# EAGLE board A20-OLinuXino-Lime2_Rev_E (EAGLE 4.16), part 1 of 6
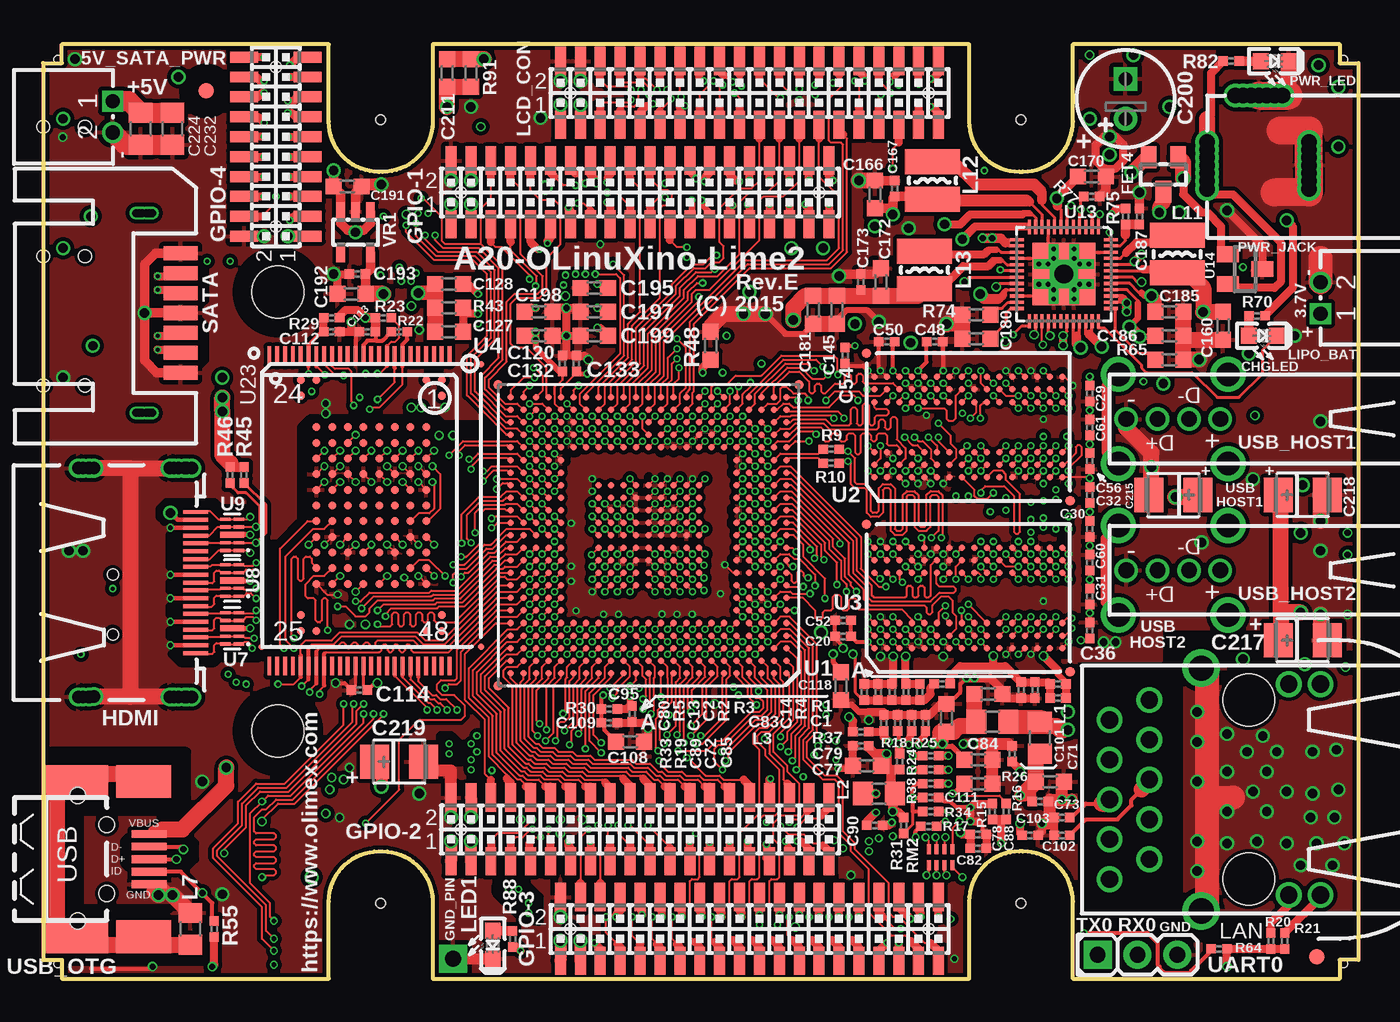
[diagram p5: board, top side]
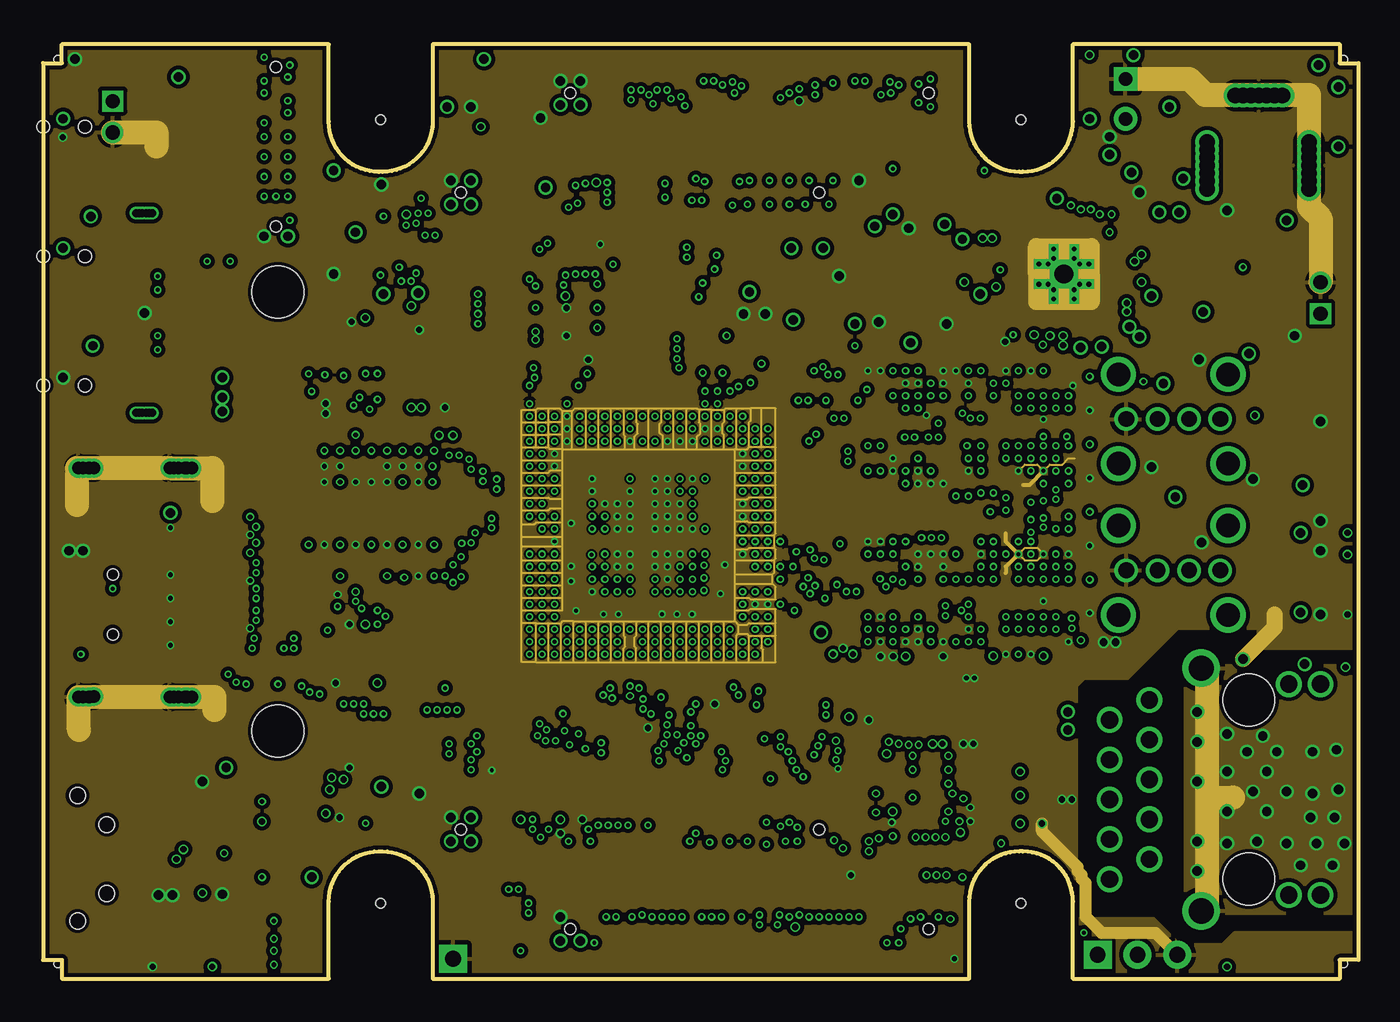
[diagram p6: board, inner layer GND]
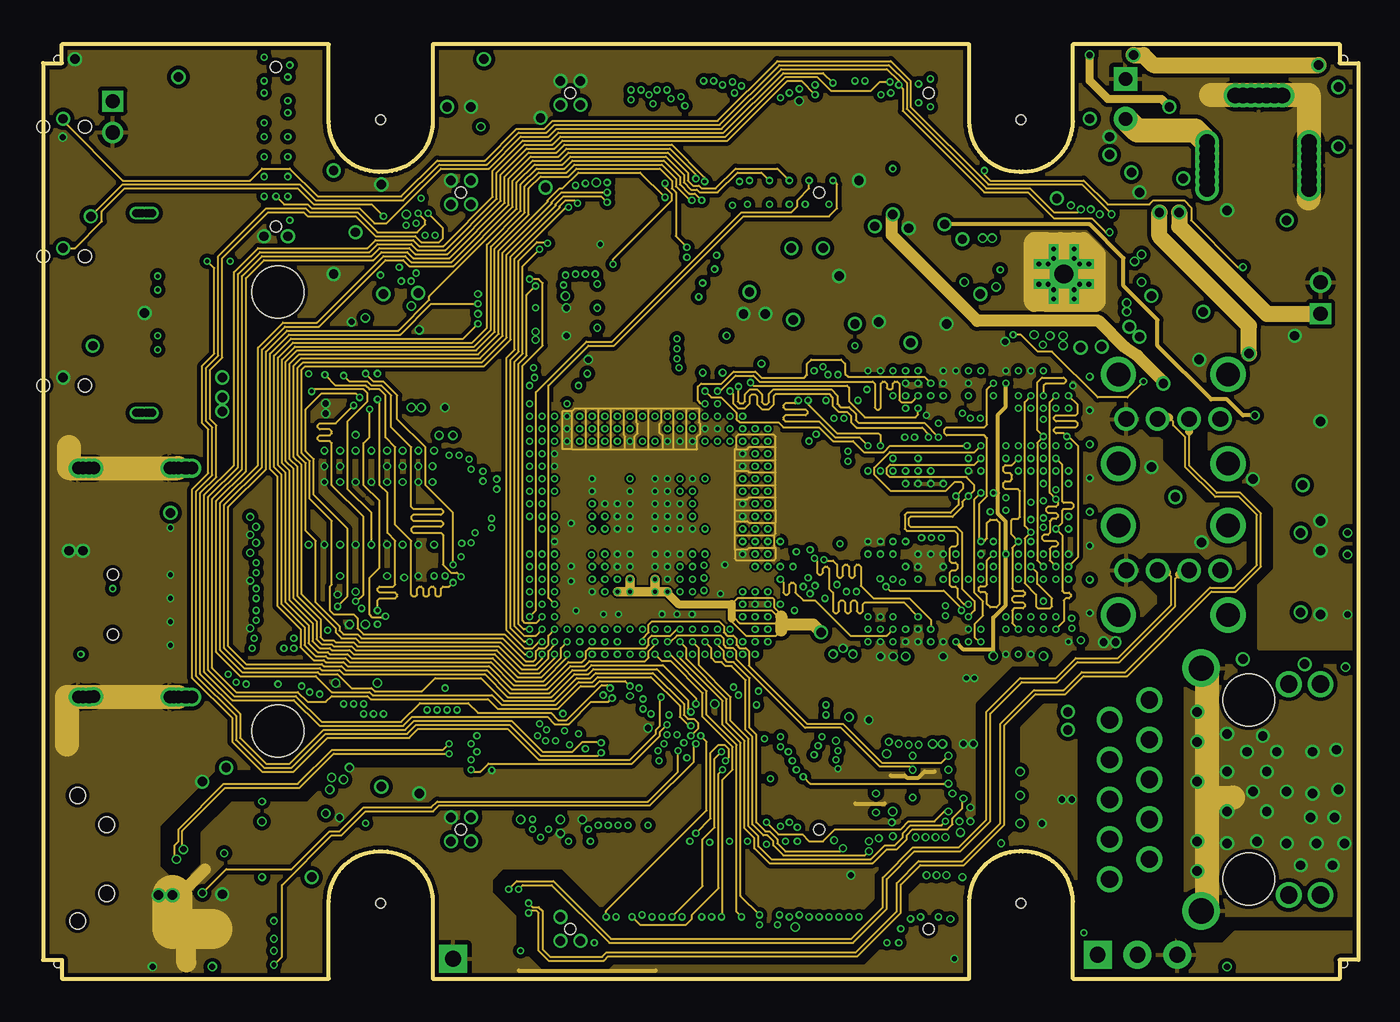
[diagram p7: board, inner layer Route3]
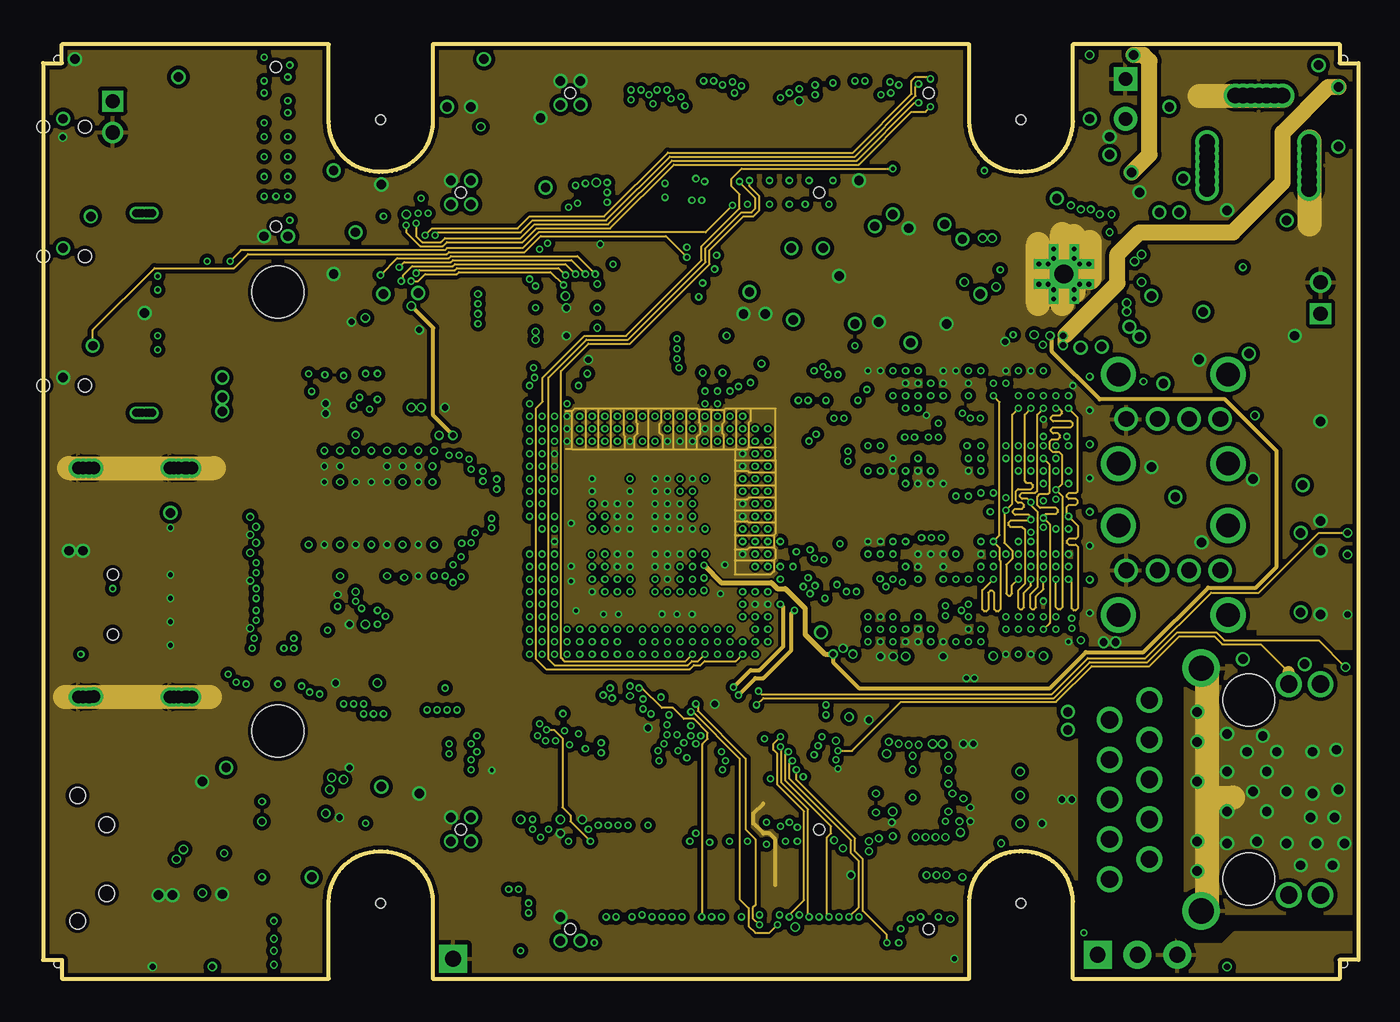
[diagram p8: board, inner layer Route4]
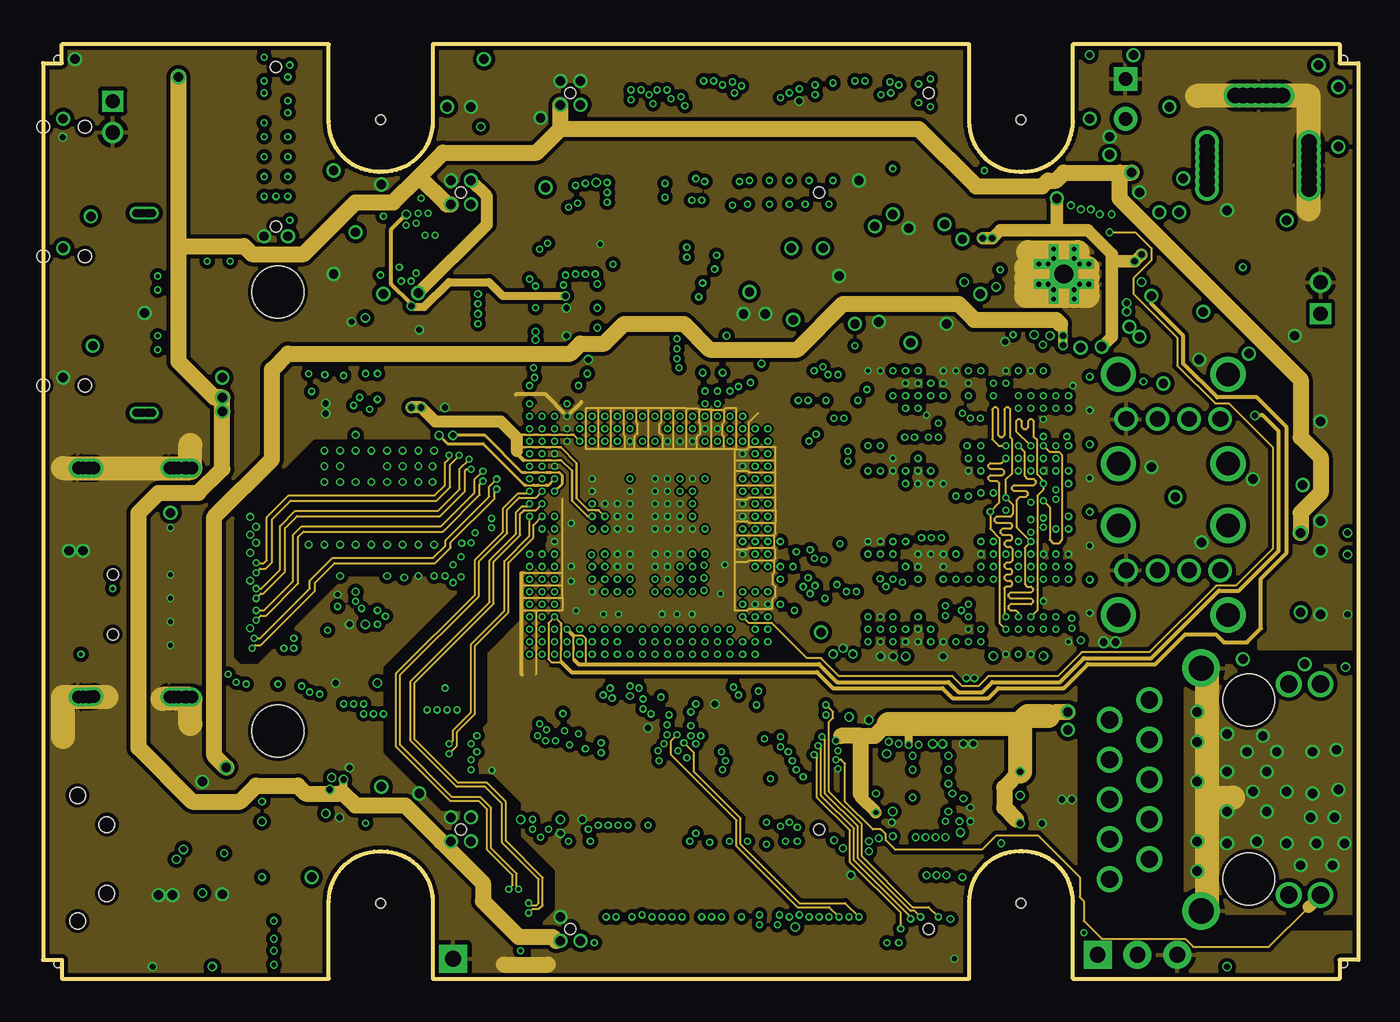
[diagram p9: board, inner layer Route13]
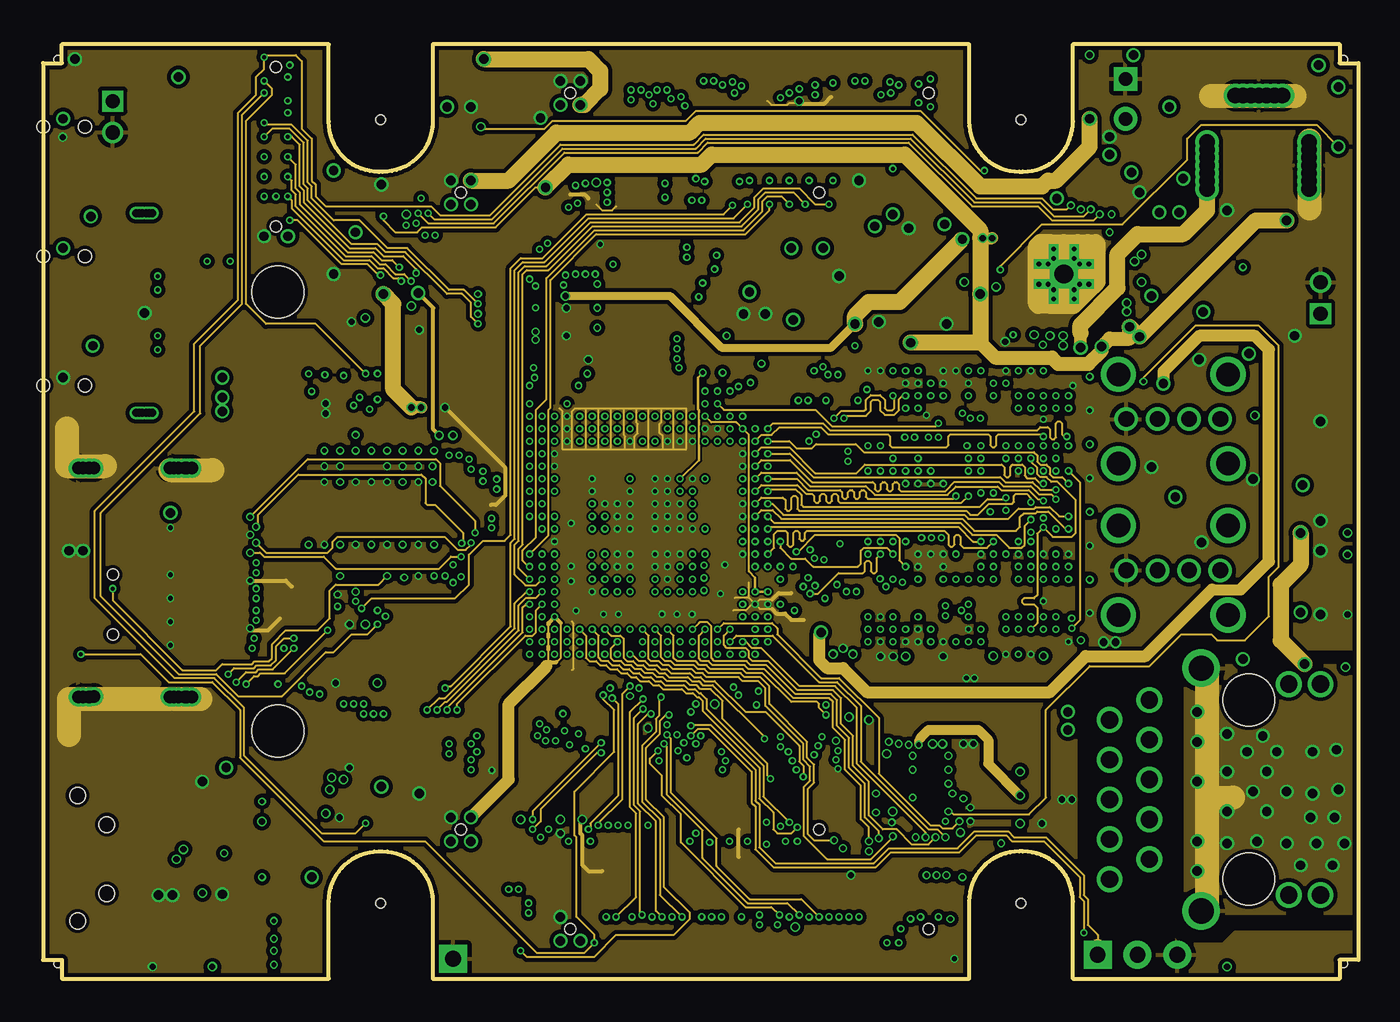
[diagram p10: board, inner layer Route14]
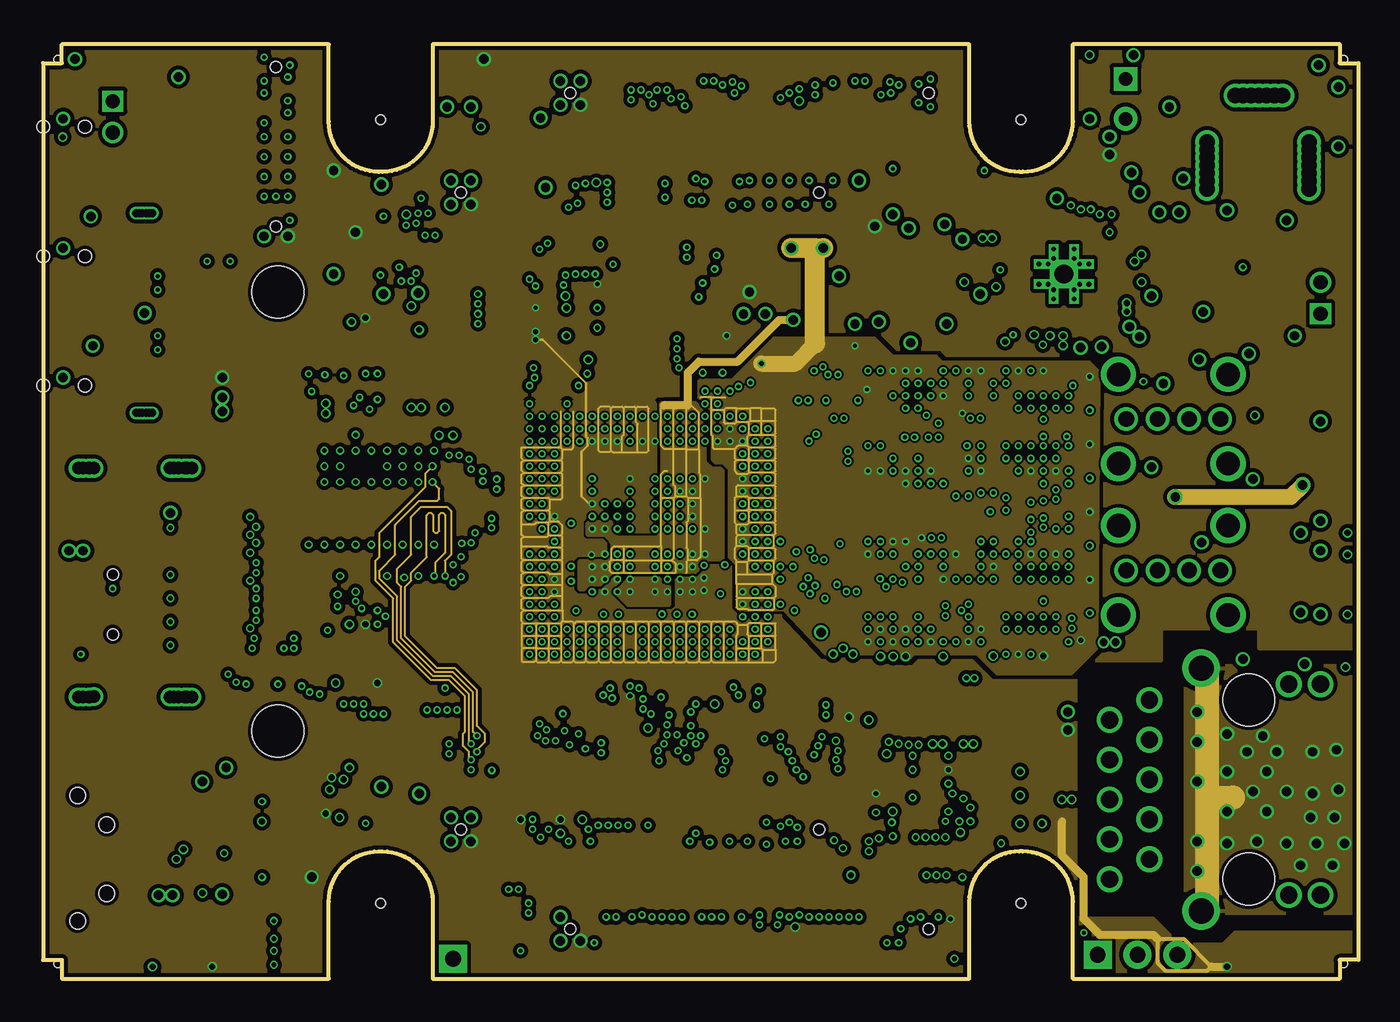
[diagram p11: board, inner layer PWR]
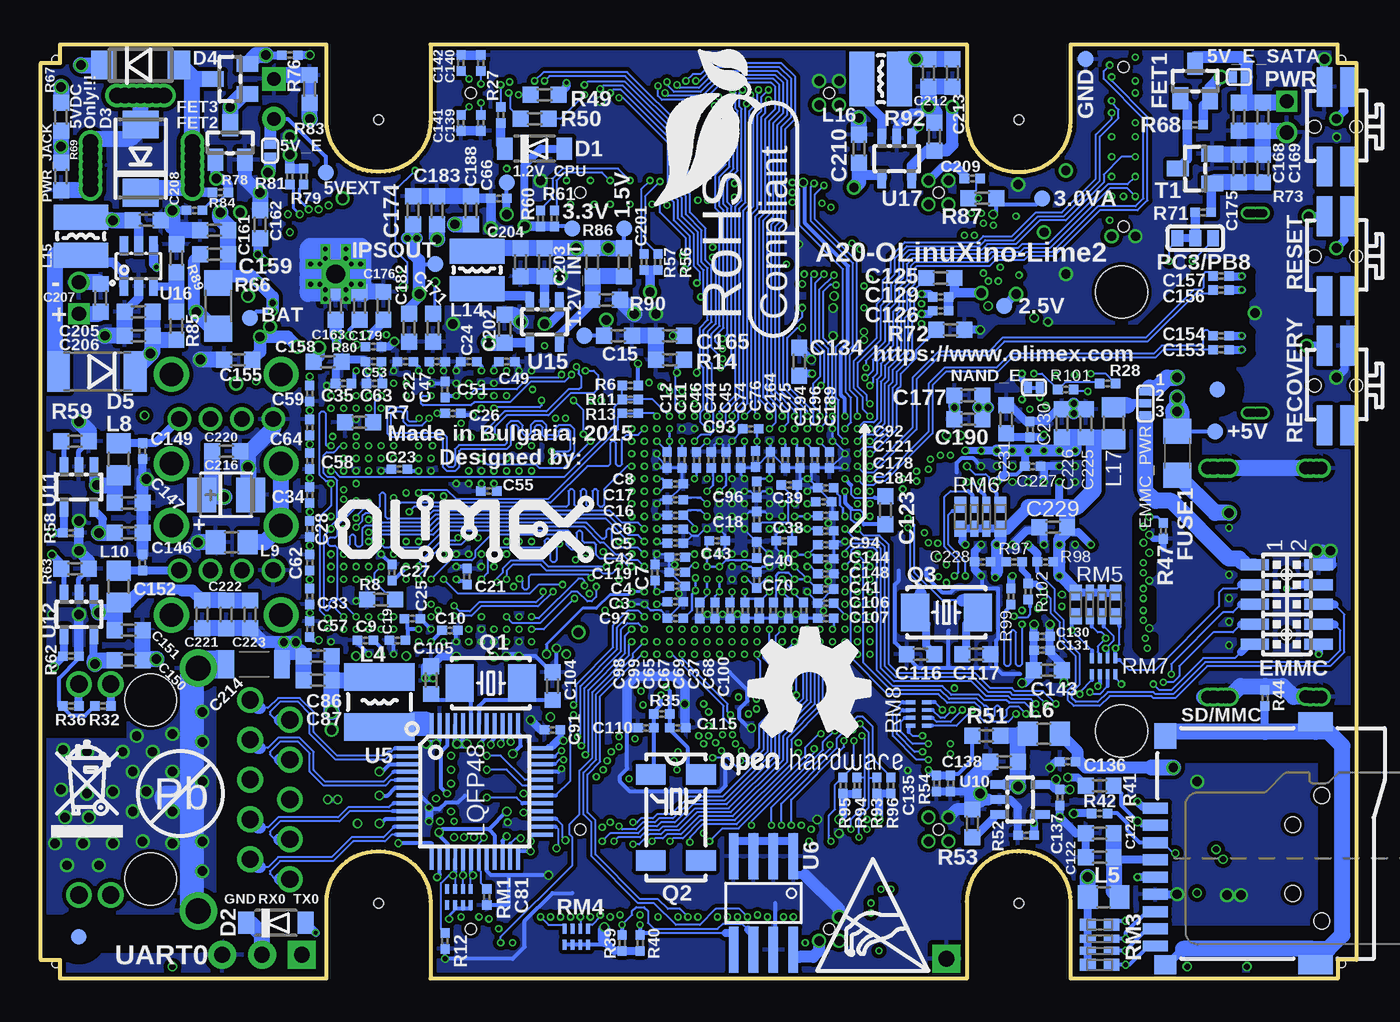
[diagram p12: board, bottom side, seen from below]

Size 83.96 x 59.61 mm. Coordinates in mm from the lower left corner, seen from the top.
Copper layers (1+2*3+4*13+14*15+16): Top 0.035mm / dielectric 0.12mm / GND 0.035mm / dielectric 0.2mm / Route3 0.035mm / dielectric 0.28mm / Route4 0.035mm / dielectric 0.2mm / Route13 0.035mm / dielectric 0.28mm / Route14 0.035mm / dielectric 0.2mm / PWR 0.035mm / dielectric 0.12mm / Bottom 0.035mm
Design rules "default": minimum track width 4.5mil, minimum drill 10mil, track to track 5mil, track to pad 5mil, pad to pad 5mil, via to via 5mil, smd to smd 1mil, copper to edge 10mil, drill to drill 8mil, minimum pad ring 6mil, minimum via ring 4mil, stop-mask expansion 4mil, vias tented up to drill 25mil, thermal gap 12mil
Net classes: 2 lan_sh: drill 0.762 mm
tRestrict: 170 lines
bRestrict: 82 lines

## Footprints (pad centres in the part's own frame; a part is rotated, then mirrored left to right if it is on the bottom)
TESTPAD_40-ROUND = smd 1.016 x 1.016: 1 0,0
SJ_1_SMALLER = smd 0.508 x 0.762: 1 -0.381,0; 2 0.381,0
DW02R = drill 0.9 square: 1 -1,0 | drill 0.9 round: 2 1,0
C0402_TI = smd 0.61 x 0.584: 1 -0.508,0; 2 0.508,0
C0603_DWS = smd 1.016 x 1.016: 1 -0.889,0; 2 0.889,0
E2,5-6,3 = drill 0.864 pad 1.524 round: + -1.27,0 | drill 0.864 pad 1.524 square: - 1.27,0
C1206_5MILS_WS_ISO = smd 1.016 x 1.778: 1 -1.778,0; 2 1.778,0
CT3528_MIL = smd 1.854 x 2.184: + 1.562,0; - -1.562,0
C0805_5MIL_DWS = smd 1.27 x 1.524: 1 -1.016,0; 2 1.016,0
LED-0603 = smd 1.016 x 1.016: A 0.889,0; C -0.889,0
SOD-123 = smd 1 x 1.4: A 1.9,0; C -1.9,0
DO214AA = smd 1.778 x 2.286: A 2.177,0; C -2.177,0
MLL-41 = smd 1.45 x 1.8: A 2.445,0; K -2.445,0
MELF-MLL41 = smd 1.45 x 2.6: 1 -2.445,0; 2 2.445,0
GPH127SMT-02X05(PA-V16X-2X5-LF) = smd 0.7 x 1.8: 1 -2.54,-2.032; 2 -2.54,2.032; 3 -1.27,-2.032; 4 -1.27,2.032; 5 0,-2.032; 6 0,2.032; 7 1.27,-2.032; 8 1.27,2.032; 9 2.54,-2.032; 10 2.54,2.032 | hole 0.7: -1.905,0; 1.905,0
SJ_2_SMALLER = smd 0.508 x 0.762: 1 -0.762,0; 2 0,0; 3 0.762,0
SOT23 = smd 1.4 x 1: 1 1.1,-0.95; 2 1.1,0.95; 3 -1.1,0
1206 = smd 1.6 x 1.8: 1 -1.4,0; 2 1.4,0
TEST_PAD40/70/SQUARE = drill 1.016 pad 1.778 square: P$1 0,0
GPH127SMT-02X20(PA-V16X-2X20-LF) = smd 0.7 x 1.8: 1 -12.065,-2.032; 2 -12.065,2.032; 3 -10.795,-2.032; 4 -10.795,2.032; 5 -9.525,-2.032; 6 -9.525,2.032; 7 -8.255,-2.032; 8 -8.255,2.032; 9 -6.985,-2.032; 10 -6.985,2.032; 11 -5.715,-2.032; 12 -5.715,2.032; 13 -4.445,-2.032; 14 -4.445,2.032; 15 -3.175,-2.032; 16 -3.175,2.032; 17 -1.905,-2.032; 18 -1.905,2.032; 19 -0.635,-2.032; 20 -0.635,2.032; 21 0.635,-2.032; 22 0.635,2.032; 23 1.905,-2.032; 24 1.905,2.032; 25 3.175,-2.032; 26 3.175,2.032; 27 4.445,-2.032; 28 4.445,2.032; 29 5.715,-2.032; 30 5.715,2.032; 31 6.985,-2.032; 32 6.985,2.032; 33 8.255,-2.032; 34 8.255,2.032; 35 9.525,-2.032; 36 9.525,2.032; 37 10.795,-2.032; 38 10.795,2.032; 39 12.065,-2.032; 40 12.065,2.032 | hole 0.7: -11.43,0; 11.43,0
GPH127SMT-02X10(PA-V16X-2X10-LF) = smd 0.7 x 1.8: 1 -5.715,-2.032; 2 -5.715,2.032; 3 -4.445,-2.032; 4 -4.445,2.032; 5 -3.175,-2.032; 6 -3.175,2.032; 7 -1.905,-2.032; 8 -1.905,2.032; 9 -0.635,-2.032; 10 -0.635,2.032; 11 0.635,-2.032; 12 0.635,2.032; 13 1.905,-2.032; 14 1.905,2.032; 15 3.175,-2.032; 16 3.175,2.032; 17 4.445,-2.032; 18 4.445,2.032; 19 5.715,-2.032; 20 5.715,2.032 | hole 0.7: -5.08,0; 5.08,0
HDMI-SWM-19 = smd 0.25 x 1.6: 1 -4.5,-5.55; 2 -4,-5.55; 3 -3.5,-5.55; 4 -3,-5.55; 5 -2.5,-5.55; 6 -2,-5.55; 7 -1.5,-5.55; 8 -1,-5.55; 9 -0.5,-5.55; 10 0,-5.55; 11 0.5,-5.55; 12 1,-5.55; 13 1.5,-5.55; 14 2,-5.55; 15 2.5,-5.55; 16 3,-5.55; 17 3.5,-5.55; 18 4,-5.55; 19 4.5,-5.55 | drill 0.8 round: P$5 -7.3,-4.85; P$7 -7.3,1.25; P$9 7.3,1.25; P$11 7.3,-4.85; P$13 -7.3,-4.45; P$15 -7.3,1.65; P$18 7.3,1.65; P$20 7.3,-4.45; P$21 -7.3,-4.15; P$22 -7.3,-5; P$23 7.3,-5; P$24 7.3,-4.15; P$25 -7.3,-5.3; P$26 7.3,-5.3; P$27 7.3,0.95; P$28 -7.275,0.95; SH1 -7.3,-3.9; SH2 -7.3,1.95; SH3 7.3,1.95; SH4 7.3,-3.9
L0805_5MIL_DWS = smd 1.27 x 1.524: 1 -1.016,0; 2 1.016,0
CD42(43) = smd 1.75 x 4.5: 1 -1.6,0; 2 1.6,0
CD32 = smd 1.6 x 3.5: 1 -1.2,0; 2 1.2,0
TM211Q01FM22_SH = drill 1.1 round: 1 -5.715,-6.35; 2 -4.445,-8.89; 3 -3.175,-6.35; 4 -1.905,-8.89; 5 -0.635,-6.35; 6 0.635,-8.89; 7 1.905,-6.35; 8 3.175,-8.89; 9 4.445,-6.35; 10 5.715,-8.89; 11 -6.731,2.54; 12 -6.731,4.572; 13 6.731,2.54; 14 6.731,4.572 | drill 1.6 round: SH1 -7.747,-3.048; SH2 7.747,-3.048 | hole 3.3: 5.715,0; -5.715,0
SJ_1_SMALLER_CLOSE_10MILS = smd 0.508 x 0.762: 1 -0.381,0; 2 0.381,0
SJ_2_SMALL_23_TIED = smd 0.762 x 1.016: 1 -1.143,0; 2 0,0; 3 1.143,0
SW_TAKT3X4 = smd 2.54 x 1.016: 1_1 -2.54,0.762; 1_2 2.54,0.762; 2_1 -2.54,-0.762; 2_2 2.54,-0.762 | hole 0.8: 0,-1.397; 0,1.27
PWR_JACK_UNI_MILLING = drill 1 round: + 0,4.75; +1 0,5.25; +2 0,5.75; +3 0,6.25; +4 0,4.25; +5 0,3.75; +6 0,3.25; - -6.5,4.75; -1 -6.5,5.25; -2 -6.5,5.75; -3 -6.5,4.25; -4 -6.5,3.75; -5 -6.5,6.25; -6 -6.5,3.25; -- -3.3,0.3; --1 -3.8,0.3; --2 -4.3,0.3; --3 -4.8,0.3; --4 -2.8,0.3; --5 -2.3,0.3; --6 -1.8,0.3
HCX-4S = smd 1.8 x 2.4: 1 -2,0; 2 2,0
MC-306 = smd 1.3 x 1.9: 1 -2.75,-1.6; 2 2.75,-1.6; 3 2.75,1.6; 4 -2.75,1.6
R0402_TI = smd 0.61 x 0.584: 1 -0.508,0; 2 0.508,0
R0603_5MIL_DWS = smd 1.016 x 1.016: 1 -0.889,0; 2 0.889,0
R0402_TI_0R = smd 0.61 x 0.584: 1 -0.508,0; 2 0.508,0
R1206_5MIL_WS = smd 1.651 x 1.778: 1 -1.46,0; 2 1.46,0
0603_0R = smd 1.016 x 1.016: 1 -0.889,0; 2 0.889,0
R_MATRIX_4_0402_25X625 = smd 0.25 x 0.625: 1.1 -0.75,-0.512; 1.2 -0.75,0.512; 2.1 -0.25,-0.512; 2.2 -0.25,0.512; 3.1 0.25,-0.512; 3.2 0.25,0.512; 4.1 0.75,-0.512; 4.2 0.75,0.512
R_MATRIX_4 = smd 0.762 x 1.016: 1.1 -1.27,-0.762; 1.2 -1.27,0.762; 4.1 1.27,-0.762; 4.2 1.27,0.762 | smd 0.508 x 1.016: 2.1 -0.381,-0.762; 2.2 -0.381,0.762; 3.1 0.381,-0.762; 3.2 0.381,0.762
SATA-PWA-07 = smd 0.9 x 2.2: 1 -4.25,-4.8; 2 -2.98,-4.8; 3 -1.71,-4.8; 4 -0.44,-4.8; 5 0.83,-4.8; 6 2.1,-4.8; 7 3.37,-4.8 | drill 0.5 round: P$1 -6.81,-2.35; P$2 -6.81,-2.15; P$3 -6.81,-2.6; P$4 -6.81,-1.95; P$5 -6.81,-3; P$11 5.93,-2.35; P$20 5.93,-2.15; P$23 5.93,-2.6; P$24 5.93,-1.95; P$26 5.93,-3; SH1 -6.81,-2.8; SH4 5.93,-2.8
TFC-WPAPR-08 = smd 1.6 x 0.7: 1 -7.375,2.25; 2 -7.375,1.15; 3 -7.375,0.05; 4 -7.375,-1.05; 5 -7.375,-2.15; 6 -7.375,-3.25; 7 -7.375,-4.35; 8 -7.375,-5.45; 9 -7.375,-6.55 | smd 1.4 x 1.2: 10 -6.75,-7.75 | smd 1.4 x 1.6: 11 -6.75,6.85 | smd 2.2 x 1.2: 12 2.85,-7.75; 13 2.85,7.75 | hole 1: 3.25,-4.95; 3.25,3.05
TFBGA441 = smd 0.4 x 0.4: A1 -8.8,-8.8; A2 -8.8,-8; A3 -8.8,-7.2; A4 -8.8,-6.4; A5 -8.8,-5.6; A6 -8.8,-4.8; A7 -8.8,-4; A8 -8.8,-3.2; A9 -8.8,-2.4; A10 -8.8,-1.6; A11 -8.8,-0.8; A12 -8.8,0; A13 -8.8,0.8; A14 -8.8,1.6; A15 -8.8,2.4; A16 -8.8,3.2; A17 -8.8,4; A18 -8.8,4.8; A19 -8.8,5.6; A20 -8.8,6.4; A21 -8.8,7.2; A22 -8.8,8; A23 -8.8,8.8; AA1 7.2,-8.8; AA2 7.2,-8; AA3 7.2,-7.2; AA4 7.2,-6.4; AA5 7.2,-5.6; AA6 7.2,-4.8; AA7 7.2,-4; AA8 7.2,-3.2; AA9 7.2,-2.4; AA10 7.2,-1.6; AA11 7.2,-0.8; AA12 7.2,0; AA13 7.2,0.8; AA14 7.2,1.6; AA15 7.2,2.4; AA16 7.2,3.2; AA17 7.2,4; AA18 7.2,4.8; AA19 7.2,5.6; AA20 7.2,6.4; AA21 7.2,7.2; AA22 7.2,8; AA23 7.2,8.8; AB1 8,-8.8; AB2 8,-8; AB3 8,-7.2; AB4 8,-6.4; AB5 8,-5.6; AB6 8,-4.8; AB7 8,-4; AB8 8,-3.2; AB9 8,-2.4; AB10 8,-1.6; AB11 8,-0.8; AB12 8,0; AB13 8,0.8; AB14 8,1.6; AB15 8,2.4; AB16 8,3.2; AB17 8,4; AB18 8,4.8; AB19 8,5.6; AB20 8,6.4; AB21 8,7.2; AB22 8,8; AB23 8,8.8; AC1 8.8,-8.8; AC2 8.8,-8; AC3 8.8,-7.2; AC4 8.8,-6.4; AC5 8.8,-5.6; AC6 8.8,-4.8; AC7 8.8,-4; AC8 8.8,-3.2; AC9 8.8,-2.4; AC10 8.8,-1.6; AC11 8.8,-0.8; AC12 8.8,0; AC13 8.8,0.8; AC14 8.8,1.6; AC15 8.8,2.4; AC16 8.8,3.2; AC17 8.8,4; AC18 8.8,4.8; AC19 8.8,5.6; AC20 8.8,6.4; AC21 8.8,7.2; AC22 8.8,8; AC23 8.8,8.8; B1 -8,-8.8; B2 -8,-8; B3 -8,-7.2; B4 -8,-6.4; B5 -8,-5.6; B6 -8,-4.8; B7 -8,-4; B8 -8,-3.2; B9 -8,-2.4; B10 -8,-1.6; B11 -8,-0.8; B12 -8,0; B13 -8,0.8; B14 -8,1.6; B15 -8,2.4; B16 -8,3.2; B17 -8,4; B18 -8,4.8; B19 -8,5.6; B20 -8,6.4; B21 -8,7.2; B22 -8,8; B23 -8,8.8; C1 -7.2,-8.8; C2 -7.2,-8; C3 -7.2,-7.2; C4 -7.2,-6.4; C5 -7.2,-5.6; C6 -7.2,-4.8; C7 -7.2,-4; C8 -7.2,-3.2; C9 -7.2,-2.4; C10 -7.2,-1.6; C11 -7.2,-0.8; C12 -7.2,0; C13 -7.2,0.8; C14 -7.2,1.6; C15 -7.2,2.4; C16 -7.2,3.2; C17 -7.2,4; C18 -7.2,4.8; C19 -7.2,5.6; C20 -7.2,6.4; C21 -7.2,7.2; C22 -7.2,8; C23 -7.2,8.8; D1 -6.4,-8.8; D2 -6.4,-8; D3 -6.4,-7.2; D4 -6.4,-6.4; D5 -6.4,-5.6; D6 -6.4,-4.8; D7 -6.4,-4; D8 -6.4,-3.2; D9 -6.4,-2.4; D10 -6.4,-1.6; D11 -6.4,-0.8; D12 -6.4,0; D13 -6.4,0.8; D14 -6.4,1.6; D15 -6.4,2.4; D16 -6.4,3.2; D17 -6.4,4; D18 -6.4,4.8; D19 -6.4,5.6; D20 -6.4,6.4; D21 -6.4,7.2; D22 -6.4,8; D23 -6.4,8.8; E1 -5.6,-8.8; E2 -5.6,-8; E3 -5.6,-7.2; E4 -5.6,-6.4; E5 -5.6,-5.6; E6 -5.6,-4.8; E7 -5.6,-4; E8 -5.6,-3.2; E9 -5.6,-2.4; E10 -5.6,-1.6; E11 -5.6,-0.8; E12 -5.6,0; E13 -5.6,0.8; E14 -5.6,1.6; E15 -5.6,2.4; E16 -5.6,3.2; E17 -5.6,4; E18 -5.6,4.8; E19 -5.6,5.6; E20 -5.6,6.4; E21 -5.6,7.2; E22 -5.6,8; E23 -5.6,8.8; F1 -4.8,-8.8; F2 -4.8,-8; F3 -4.8,-7.2; F4 -4.8,-6.4; F5 -4.8,-5.6; F19 -4.8,5.6; F20 -4.8,6.4; F21 -4.8,7.2; F22 -4.8,8; F23 -4.8,8.8; G1 -4,-8.8; G2 -4,-8; G3 -4,-7.2; G4 -4,-6.4; G5 -4,-5.6; G19 -4,5.6; G20 -4,6.4; G21 -4,7.2; G22 -4,8; G23 -4,8.8; H1 -3.2,-8.8; H2 -3.2,-8; H3 -3.2,-7.2; H4 -3.2,-6.4; H5 -3.2,-5.6; H8 -3.2,-3.2; H9 -3.2,-2.4; H10 -3.2,-1.6; H11 -3.2,-0.8; H12 -3.2,0; H13 -3.2,0.8; H14 -3.2,1.6; H15 -3.2,2.4; H16 -3.2,3.2; H19 -3.2,5.6; H20 -3.2,6.4; H21 -3.2,7.2; H22 -3.2,8; H23 -3.2,8.8; J1 -2.4,-8.8; J2 -2.4,-8; J3 -2.4,-7.2; J4 -2.4,-6.4; J5 -2.4,-5.6; J8 -2.4,-3.2; J9 -2.4,-2.4; J10 -2.4,-1.6; J11 -2.4,-0.8; J12 -2.4,0; J13 -2.4,0.8; J14 -2.4,1.6; J15 -2.4,2.4; J16 -2.4,3.2; J19 -2.4,5.6; J20 -2.4,6.4; J21 -2.4,7.2; J22 -2.4,8; J23 -2.4,8.8; K1 -1.6,-8.8; K2 -1.6,-8; K3 -1.6,-7.2; K4 -1.6,-6.4; K5 -1.6,-5.6; K8 -1.6,-3.2; K9 -1.6,-2.4; K10 -1.6,-1.6; K11 -1.6,-0.8; K12 -1.6,0; K13 -1.6,0.8; K14 -1.6,1.6; K15 -1.6,2.4; K16 -1.6,3.2; K19 -1.6,5.6; K20 -1.6,6.4; K21 -1.6,7.2; K22 -1.6,8; K23 -1.6,8.8; L1 -0.8,-8.8; L2 -0.8,-8; L3 -0.8,-7.2; L4 -0.8,-6.4; L5 -0.8,-5.6; L8 -0.8,-3.2; L9 -0.8,-2.4; L10 -0.8,-1.6; L11 -0.8,-0.8; L12 -0.8,0; L13 -0.8,0.8; L14 -0.8,1.6; L15 -0.8,2.4; L16 -0.8,3.2; L19 -0.8,5.6; L20 -0.8,6.4; L21 -0.8,7.2; L22 -0.8,8; L23 -0.8,8.8; M1 0,-8.8; M2 0,-8; M3 0,-7.2; M4 0,-6.4; M5 0,-5.6; M8 0,-3.2; M9 0,-2.4; M10 0,-1.6; M11 0,-0.8; M12 0,0; M13 0,0.8; M14 0,1.6; M15 0,2.4; M16 0,3.2; M19 0,5.6; M20 0,6.4; M21 0,7.2; M22 0,8; M23 0,8.8; N1 0.8,-8.8; N2 0.8,-8; N3 0.8,-7.2; N4 0.8,-6.4; N5 0.8,-5.6; N8 0.8,-3.2; N9 0.8,-2.4; N10 0.8,-1.6; N11 0.8,-0.8; N12 0.8,0; N13 0.8,0.8; N14 0.8,1.6; N15 0.8,2.4; N16 0.8,3.2; N19 0.8,5.6; N20 0.8,6.4; N21 0.8,7.2; N22 0.8,8; N23 0.8,8.8; P1 1.6,-8.8; P2 1.6,-8; P3 1.6,-7.2; P4 1.6,-6.4; P5 1.6,-5.6; P8 1.6,-3.2; P9 1.6,-2.4; P10 1.6,-1.6; P11 1.6,-0.8; P12 1.6,0; P13 1.6,0.8; P14 1.6,1.6; P15 1.6,2.4; P16 1.6,3.2; P19 1.6,5.6; P20 1.6,6.4; P21 1.6,7.2; P22 1.6,8; P23 1.6,8.8; R1 2.4,-8.8; R2 2.4,-8; R3 2.4,-7.2; R4 2.4,-6.4; R5 2.4,-5.6; R8 2.4,-3.2; R9 2.4,-2.4; R10 2.4,-1.6; R11 2.4,-0.8; R12 2.4,0; R13 2.4,0.8; R14 2.4,1.6; R15 2.4,2.4; R16 2.4,3.2; R19 2.4,5.6; R20 2.4,6.4; R21 2.4,7.2; R22 2.4,8; R23 2.4,8.8; T1 3.2,-8.8; T2 3.2,-8; T3 3.2,-7.2; T4 3.2,-6.4; T5 3.2,-5.6; T8 3.2,-3.2; T9 3.2,-2.4; T10 3.2,-1.6; T11 3.2,-0.8; T12 3.2,0; T13 3.2,0.8; T14 3.2,1.6; T15 3.2,2.4; T16 3.2,3.2; T19 3.2,5.6; T20 3.2,6.4; T21 3.2,7.2; T22 3.2,8; T23 3.2,8.8; U1 4,-8.8; U2 4,-8; U3 4,-7.2; U4 4,-6.4; U5 4,-5.6; U19 4,5.6; U20 4,6.4; U21 4,7.2; U22 4,8; U23 4,8.8; V1 4.8,-8.8; V2 4.8,-8; V3 4.8,-7.2; V4 4.8,-6.4; V5 4.8,-5.6; V19 4.8,5.6; V20 4.8,6.4; V21 4.8,7.2; V22 4.8,8; V23 4.8,8.8; W1 5.6,-8.8; W2 5.6,-8; W3 5.6,-7.2; W4 5.6,-6.4; W5 5.6,-5.6; W6 5.6,-4.8; W7 5.6,-4; W8 5.6,-3.2; W9 5.6,-2.4; W10 5.6,-1.6; W11 5.6,-0.8; W12 5.6,0; W13 5.6,0.8; W14 5.6,1.6; W15 5.6,2.4; W16 5.6,3.2; W17 5.6,4; W18 5.6,4.8; W19 5.6,5.6; W20 5.6,6.4; W21 5.6,7.2; W22 5.6,8; W23 5.6,8.8; Y1 6.4,-8.8; Y2 6.4,-8; Y3 6.4,-7.2; Y4 6.4,-6.4; Y5 6.4,-5.6; Y6 6.4,-4.8; Y7 6.4,-4; Y8 6.4,-3.2; Y9 6.4,-2.4; Y10 6.4,-1.6; Y11 6.4,-0.8; Y12 6.4,0; Y13 6.4,0.8; Y14 6.4,1.6; Y15 6.4,2.4; Y16 6.4,3.2; Y17 6.4,4; Y18 6.4,4.8; Y19 6.4,5.6; Y20 6.4,6.4; Y21 6.4,7.2; Y22 6.4,8; Y23 6.4,8.8 | smd 0.6 x 0.6: FID1 -9.6,9.6; FID2 9.6,9.6; FID3 9.6,-9.6
FBGA96_SK = smd 0.4 x 0.4: A1 -6,-3.2; A2 -6,-2.4; A3 -6,-1.6; A7 -6,1.6; A8 -6,2.4; A9 -6,3.2; B1 -5.2,-3.2; B2 -5.2,-2.4; B3 -5.2,-1.6; B7 -5.2,1.6; B8 -5.2,2.4; B9 -5.2,3.2; C1 -4.4,-3.2; C2 -4.4,-2.4; C3 -4.4,-1.6; C7 -4.4,1.6; C8 -4.4,2.4; C9 -4.4,3.2; D1 -3.6,-3.2; D2 -3.6,-2.4; D3 -3.6,-1.6; D7 -3.6,1.6; D8 -3.6,2.4; D9 -3.6,3.2; E1 -2.8,-3.2; E2 -2.8,-2.4; E3 -2.8,-1.6; E7 -2.8,1.6; E8 -2.8,2.4; E9 -2.8,3.2; F1 -2,-3.2; F2 -2,-2.4; F3 -2,-1.6; F7 -2,1.6; F8 -2,2.4; F9 -2,3.2; G1 -1.2,-3.2; G2 -1.2,-2.4; G3 -1.2,-1.6; G7 -1.2,1.6; G8 -1.2,2.4; G9 -1.2,3.2; H1 -0.4,-3.2; H2 -0.4,-2.4; H3 -0.4,-1.6; H7 -0.4,1.6; H8 -0.4,2.4; H9 -0.4,3.2; J1 0.4,-3.2; J2 0.4,-2.4; J3 0.4,-1.6; J7 0.4,1.6; J8 0.4,2.4; J9 0.4,3.2; K1 1.2,-3.2; K2 1.2,-2.4; K3 1.2,-1.6; K7 1.2,1.6; K8 1.2,2.4; K9 1.2,3.2; L1 2,-3.2; L2 2,-2.4; L3 2,-1.6; L7 2,1.6; L8 2,2.4; L9 2,3.2; M1 2.8,-3.2; M2 2.8,-2.4; M3 2.8,-1.6; M7 2.8,1.6; M8 2.8,2.4; M9 2.8,3.2; N1 3.6,-3.2; N2 3.6,-2.4; N3 3.6,-1.6; N7 3.6,1.6; N8 3.6,2.4; N9 3.6,3.2; P1 4.4,-3.2; P2 4.4,-2.4; P3 4.4,-1.6; P7 4.4,1.6; P8 4.4,2.4; P9 4.4,3.2; R1 5.2,-3.2; R2 5.2,-2.4; R3 5.2,-1.6; R7 5.2,1.6; R8 5.2,2.4; R9 5.2,3.2; T1 6,-3.2; T2 6,-2.4; T3 6,-1.6; T7 6,1.6; T8 6,2.4; T9 6,3.2 | smd 0.6 x 0.6: FID1 6.5,-4.7; FID2 -6.5,4.7
TSOP48 = smd 1.2 x 0.25: 1 -9.9,5.75; 2 -9.9,5.25; 3 -9.9,4.75; 4 -9.9,4.25; 5 -9.9,3.75; 6 -9.9,3.25; 7 -9.9,2.75; 8 -9.9,2.25; 9 -9.9,1.75; 10 -9.9,1.25; 11 -9.9,0.75; 12 -9.9,0.25; 13 -9.9,-0.25; 14 -9.9,-0.75; 15 -9.9,-1.25; 16 -9.9,-1.75; 17 -9.9,-2.25; 18 -9.9,-2.75; 19 -9.9,-3.25; 20 -9.9,-3.75; 21 -9.9,-4.25; 22 -9.9,-4.75; 23 -9.9,-5.25; 24 -9.9,-5.75; 25 9.9,-5.75; 26 9.9,-5.25; 27 9.9,-4.75; 28 9.9,-4.25; 29 9.9,-3.75; 30 9.9,-3.25; 31 9.9,-2.75; 32 9.9,-2.25; 33 9.9,-1.75; 34 9.9,-1.25; 35 9.9,-0.75; 36 9.9,-0.25; 37 9.9,0.25; 38 9.9,0.75; 39 9.9,1.25; 40 9.9,1.75; 41 9.9,2.25; 42 9.9,2.75; 43 9.9,3.25; 44 9.9,3.75; 45 9.9,4.25; 46 9.9,4.75; 47 9.9,5.25; 48 9.9,5.75
LQFP48 = smd 0.254 x 1.4: 1 -2.75,-4.3; 2 -2.25,-4.3; 3 -1.75,-4.3; 4 -1.25,-4.3; 5 -0.75,-4.3; 6 -0.25,-4.3; 7 0.25,-4.3; 8 0.75,-4.3; 9 1.25,-4.3; 10 1.75,-4.3; 11 2.25,-4.3; 12 2.75,-4.3; 25 2.75,4.3; 26 2.25,4.3; 27 1.75,4.3; 28 1.25,4.3; 29 0.75,4.3; 30 0.25,4.3; 31 -0.25,4.3; 32 -0.75,4.3; 33 -1.25,4.3; 34 -1.75,4.3; 35 -2.25,4.3; 36 -2.75,4.3 | smd 1.4 x 0.254: 13 4.3,-2.75; 14 4.3,-2.25; 15 4.3,-1.75; 16 4.3,-1.25; 17 4.3,-0.75; 18 4.3,-0.25; 19 4.3,0.25; 20 4.3,0.75; 21 4.3,1.25; 22 4.3,1.75; 23 4.3,2.25; 24 4.3,2.75; 37 -4.3,2.75; 38 -4.3,2.25; 39 -4.3,1.75; 40 -4.3,1.25; 41 -4.3,0.75; 42 -4.3,0.25; 43 -4.3,-0.25; 44 -4.3,-0.75; 45 -4.3,-1.25; 46 -4.3,-1.75; 47 -4.3,-2.25; 48 -4.3,-2.75
SO-08MN = smd 0.61 x 2.921: 1 -1.905,-2.981; 2 -0.635,-2.981; 3 0.635,-2.981; 4 1.905,-2.981; 5 1.905,2.981; 6 0.635,2.981; 7 -0.635,2.981; 8 -1.905,2.981
SLP2510P8 = smd 0.2 x 0.675: 1 -1,-0.438; 2 -0.5,-0.438; 4 0.5,-0.438; 5 1,-0.438; 6 1,0.438; 7 0.5,0.438; 9 -0.5,0.438; 10 -1,0.438 | smd 0.4 x 0.775: 3 0,-0.388; 8 0,0.388
SOT23-5 = smd 1.2 x 0.55: 1 1.3,-0.95; 2 1.3,0; 3 1.3,0.95; 4 -1.3,0.95; 5 -1.3,-0.95
QFN48 = smd 0.2 x 0.9: 1 -2.2,-3; 2 -1.8,-3; 3 -1.4,-3; 4 -1,-3; 5 -0.6,-3; 6 -0.2,-3; 7 0.2,-3; 8 0.6,-3; 9 1,-3; 10 1.4,-3; 11 1.8,-3; 12 2.2,-3; 25 2.2,3; 26 1.8,3; 27 1.4,3; 28 1,3; 29 0.6,3; 30 0.2,3; 31 -0.2,3; 32 -0.6,3; 33 -1,3; 34 -1.4,3; 35 -1.8,3; 36 -2.2,3 | smd 0.9 x 0.2: 13 3,-2.2; 14 3,-1.8; 15 3,-1.4; 16 3,-1; 17 3,-0.6; 18 3,-0.2; 19 3,0.2; 20 3,0.6; 21 3,1; 22 3,1.4; 23 3,1.8; 24 3,2.2; 37 -3,2.2; 38 -3,1.8; 39 -3,1.4; 40 -3,1; 41 -3,0.6; 42 -3,0.2; 43 -3,-0.2; 44 -3,-0.6; 45 -3,-1; 46 -3,-1.4; 47 -3,-1.8; 48 -3,-2.2 | drill 1.2 pad 1.422 square: N1 0,0 | drill 0.3 pad 0.4 square: N2 -1.6,0.65; N3 -1,0.65; N4 -1.6,-0.65; N5 -1,-0.65; N6 -0.65,-1.6; N7 -0.65,-1; N8 0.65,-1.6; N9 0.65,-1; N10 1.6,-0.65; N11 1,-0.65; N12 1.6,0.65; N13 1,0.65; N14 0.65,1.6; N15 0.65,1; N16 -0.65,1.6; N17 -0.65,1 | smd 4 x 4: VSS 0,0
SOT23-6 = smd 1.2 x 0.55: 1 1.3,-0.95; 2 1.3,0; 3 1.3,0.95; 4 -1.3,0.95; 5 -1.3,0; 6 -1.3,-0.95
FIDUCIAL-1X3 = smd 1 x 1: 1 0,0
TBGA100 = smd 0.5 x 0.5: A1 -8,-4.5; A2 -8,-3.5; A9 -8,3.5; A10 -8,4.5; B1 -7,-4.5; B10 -7,4.5; D2 -5,-3.5; D3 -5,-2.5; D4 -5,-1.5; D5 -5,-0.5; D6 -5,0.5; D7 -5,1.5; D8 -5,2.5; D9 -5,3.5; E2 -4,-3.5; E3 -4,-2.5; E4 -4,-1.5; E5 -4,-0.5; E6 -4,0.5; E7 -4,1.5; E8 -4,2.5; E9 -4,3.5; F2 -3,-3.5; F3 -3,-2.5; F4 -3,-1.5; F5 -3,-0.5; F6 -3,0.5; F7 -3,1.5; F8 -3,2.5; F9 -3,3.5; G2 -2,-3.5; G3 -2,-2.5; G4 -2,-1.5; G5 -2,-0.5; G6 -2,0.5; G7 -2,1.5; G8 -2,2.5; G9 -2,3.5; H2 -1,-3.5; H3 -1,-2.5; H4 -1,-1.5; H5 -1,-0.5; H6 -1,0.5; H7 -1,1.5; H8 -1,2.5; H9 -1,3.5; J2 0,-3.5; J3 0,-2.5; J4 0,-1.5; J5 0,-0.5; J6 0,0.5; J7 0,1.5; J8 0,2.5; J9 0,3.5; K2 1,-3.5; K3 1,-2.5; K4 1,-1.5; K5 1,-0.5; K6 1,0.5; K7 1,1.5; K8 1,2.5; K9 1,3.5; L2 2,-3.5; L3 2,-2.5; L4 2,-1.5; L5 2,-0.5; L6 2,0.5; L7 2,1.5; L8 2,2.5; L9 2,3.5; M2 3,-3.5; M3 3,-2.5; M4 3,-1.5; M5 3,-0.5; M6 3,0.5; M7 3,1.5; M8 3,2.5; M9 3,3.5; N2 4,-3.5; N3 4,-2.5; N4 4,-1.5; N5 4,-0.5; N6 4,0.5; N7 4,1.5; N8 4,2.5; N9 4,3.5; P2 5,-3.5; P3 5,-2.5; P4 5,-1.5; P5 5,-0.5; P6 5,0.5; P7 5,1.5; P8 5,2.5; P9 5,3.5; T1 7,-4.5; T10 7,4.5; U1 8,-4.5; U2 8,-3.5; U9 8,3.5; U10 8,4.5 | smd 0.4 x 0.4: FID1 9,-7; FID2 9,7; FID3 -9,7
HAMMOND_1593LBK_A10_LIME = hole 3.3: 14.98,15.81; 14.98,43.81 | hole 0.6: 21.55,4.81; 21.55,54.81; 62.41,4.81; 62.41,54.81 | hole 0.5: 0.95,58.66; 83.01,58.66; 83.01,0.95; 0.95,0.95
HN1X3 = drill 1 pad 1.778 square: 1 -2.54,0 | drill 1 pad 1.778 round: 2 0,0; 3 2.54,0
USB_A_VERTICAL_PTH = drill 1 round: 1 3.45,12.75; 2 3.45,14.75; 3 3.45,16.75; 4 3.45,18.75 | drill 1.5 round: P$1 0.6,12.25; P$2 6.3,12.25; P$3 6.3,19.25; P$4 0.6,19.25
USB_MINI_9PIN = smd 2.25 x 0.5: D+ -5.246,0; D- -5.246,-0.8; GND -5.246,1.6; ID -5.246,0.8; VBUS -5.246,-1.6 | smd 4 x 2.1: GND1 -0.64,-4.95; GND3 -0.64,4.95 | smd 3.5 x 2.1: GND2 -4.89,-4.95; GND4 -4.89,4.95 | hole 1: -2.54,-2.2; -2.54,2.2
SOT-23-5 = smd 1.2 x 0.55: 1 1.3,-0.95; 2 1.3,0; 3 1.3,0.95; 4 -1.3,0.95; 5 -1.3,-0.95

## Placement (x,y rotation side)
1.2V_CPU  TESTPADTESTPAD_40-ROUND  [TESTPAD_40-ROUND]  54.23,50.8 0 bottom
1.2V_INT  TESTPADTESTPAD_40-ROUND  [TESTPAD_40-ROUND]  49.28,41.02 0 bottom
1.5V  TESTPADTESTPAD_40-ROUND  [TESTPAD_40-ROUND]  46.74,47.88 0 bottom
2.5V  TESTPADTESTPAD_40-ROUND  [TESTPAD_40-ROUND]  22.48,42.93 0 bottom
3.0VA  TESTPADTESTPAD_40-ROUND  [TESTPAD_40-ROUND]  20.07,49.78 0 bottom
3.3V  TESTPADTESTPAD_40-ROUND  [TESTPAD_40-ROUND]  50.04,47.88 0 bottom
5V_E  Opened  [SJ_1_SMALLER]  69.34,52.83 270 bottom
5V_E_SATA  Opened  [SJ_1_SMALLER]  7.49,57.53 0 bottom
5V_SATA_PWR  DW02R  [DW02R]  4.45,54.99 270 top
5VEXT  TESTPADTESTPAD_40-ROUND  [TESTPAD_40-ROUND]  65.79,51.44 0 bottom
+5V  TESTPADTESTPAD_40-ROUND  [TESTPAD_40-ROUND]  9.02,34.92 0 bottom
BAT  TESTPADTESTPAD_40-ROUND  [TESTPAD_40-ROUND]  70.61,42.16 0 bottom
C1  220nF  [C0402_TI]  64.77,17.91 180 top
C2  220nF  [C0402_TI]  55.07,18.29 270 top
C3  220nF  [C0402_TI]  43.46,24.05 180 bottom
C4  220nF  [C0402_TI]  43.36,25.04 180 bottom
C5  220nF  [C0402_TI]  43.46,27.79 180 bottom
C6  220nF  [C0402_TI]  43.46,28.68 180 bottom
C7  220nF  [C0402_TI]  44.77,25.91 270 bottom
C8  220nF  [C0402_TI]  43.46,31.57 180 bottom
C9  220nF  [C0402_TI]  63.25,21.59 0 bottom
C10  220nF  [C0402_TI]  57.85,22.22 180 bottom
C11  220nF  [C0402_TI]  43.05,33.1 90 bottom
C12  220nF  [C0402_TI]  43.99,33.1 90 bottom
C13  220nF  [C0402_TI]  54.18,18.29 270 top
C14  220nF  [C0402_TI]  62.42,18.41 90 top
C15  22uF/6.3V  [C0603_DWS]  47.12,41.02 180 bottom
C16  220nF  [C0402_TI]  43.46,29.57 0 bottom
C17  220nF  [C0402_TI]  43.46,30.56 0 bottom
C18  220nF  [C0402_TI]  38.28,29.29 270 bottom
C19  220nF  [C0402_TI]  61.21,21.59 0 bottom
C20  220nF  [C0402_TI]  51.05,21.84 0 top
C21  220nF  [C0402_TI]  56.77,25.65 270 bottom
C22  220nF  [C0402_TI]  60.71,39.37 0 bottom
C23  220nF  [C0402_TI]  61.09,32.51 0 bottom
C24  220nF  [C0402_TI]  56.64,39.37 0 bottom
C25  220nF  [C0402_TI]  60.25,22.97 180 bottom
C26  220nF  [C0402_TI]  57.66,36.07 180 bottom
C27  220nF  [C0402_TI]  61.55,25.92 270 bottom
C28  220nF  [C0402_TI]  66.8,28.7 90 bottom
C29  220nF  [C0402_TI]  66.8,37.34 90 top
C30  220nF  [C0402_TI]  66.8,28.7 90 top
C31  220nF  [C0402_TI]  66.8,24.38 90 top
C32  220nF  [C0402_TI]  66.8,30.86 270 top
C33  220nF  [C0402_TI]  66.8,24.38 90 bottom
C34  220nF  [C0402_TI]  66.8,30.86 270 bottom
C35  220nF  [C0402_TI]  64.64,37.97 0 bottom
C36  220nF  [C0402_TI]  66.8,22.22 270 top
C37  220nF  [C0402_TI]  37.21,23.5 90 bottom
C38  220nF  [C0402_TI]  36.53,27.94 0 bottom
C39  220nF  [C0402_TI]  36.19,31.5 180 bottom
C40  220nF  [C0402_TI]  38.28,27.36 270 bottom
C41  220nF  [C0402_TI]  33.86,24.87 180 bottom
C42  220nF  [C0402_TI]  43.36,26.9 0 bottom
C43  220nF  [C0402_TI]  40.79,27.94 180 bottom
C44  220nF  [C0402_TI]  41.17,33.1 270 bottom
C45  220nF  [C0402_TI]  40.23,33.1 270 bottom
C46  220nF  [C0402_TI]  42.11,33.1 270 bottom
C47  220nF  [C0402_TI]  58.67,39.37 180 bottom
C48  220nF  [C0402_TI]  56.9,40.64 180 top
C49  220nF  [C0402_TI]  54.23,39.37 180 bottom
C50  220nF  [C0402_TI]  53.85,40.64 0 top
C51  220nF  [C0402_TI]  58.17,37.59 270 bottom
C52  220nF  [C0402_TI]  51.05,22.86 0 top
C53  220nF  [C0402_TI]  62.74,39.37 0 bottom
C54  220nF  [C0402_TI]  51.18,39.75 90 top
C55  220nF  [C0402_TI]  55.37,31.11 0 bottom
C56  220nF  [C0402_TI]  66.8,33.02 90 top
C57  220nF  [C0402_TI]  66.8,22.3 270 bottom
C58  220nF  [C0402_TI]  66.8,33.02 90 bottom
C59  220nF  [C0402_TI]  66.8,37.34 90 bottom
C60  220nF  [C0402_TI]  66.8,26.54 270 top
C61  220nF  [C0402_TI]  66.8,35.18 270 top
C62  220nF  [C0402_TI]  66.8,26.54 270 bottom
C63  220nF  [C0402_TI]  62.67,37.97 0 bottom
C64  220nF  [C0402_TI]  66.8,35.18 270 bottom
C65  220nF  [C0402_TI]  39.98,23.5 90 bottom
C66  220nF  [C0402_TI]  54.74,49.78 0 bottom
C67  220nF  [C0402_TI]  39.01,23.5 90 bottom
C68  220nF  [C0402_TI]  36.25,23.5 90 bottom
C69  220nF  [C0402_TI]  38.11,23.5 90 bottom
C70  220nF  [C0402_TI]  38.28,25.43 270 bottom
C71  22uF/6.3V  [C0603_DWS]  64.26,12.57 180 top
C72  100nF  [C0402_TI]  56.32,16.32 270 top
C73  100nF  [C0402_TI]  63.63,11.3 180 top
C74  220nF  [C0402_TI]  39.29,33.1 90 bottom
C75  220nF  [C0402_TI]  36.45,33.1 90 bottom
C76  220nF  [C0402_TI]  38.35,33.15 90 bottom
C77  22uF/6.3V  [C0603_DWS]  52.58,13.59 0 top
C78  100nF  [C0402_TI]  59.69,9.21 180 top
C79  100nF  [C0402_TI]  52.2,14.86 0 top
C80  NA  [C0402_TI]  52.4,18.29 270 top
C81  NA  [C0402_TI]  55.5,5.21 270 bottom
C82  100nF  [C0402_TI]  59.69,8.32 180 top
C83  22uF/6.3V  [C0603_DWS]  60.33,18.16 180 top
C84  22uF/6.3V  [C0603_DWS]  59.69,13.97 180 top
C85  22uF/6.3V  [C0603_DWS]  57.66,16.64 270 top
C86  22uF/6.3V  [C0603_DWS]  66.29,20.57 0 bottom
C87  22uF/6.3V  [C0603_DWS]  66.29,19.05 0 bottom
C88  100nF  [C0402_TI]  62.99,9.14 180 top
C89  100nF  [C0402_TI]  55.44,16.32 270 top
C90  100nF  [C0402_TI]  53.09,9.78 180 top
C91  100nF  [C0402_TI]  51.31,15.88 0 bottom
C92  220nF  [C0402_TI]  33.86,31.32 0 bottom
C93  220nF  [C0402_TI]  38.66,35.08 0 bottom
C94  220nF  [C0402_TI]  33.86,27.69 180 bottom
C95  220nF  [C0402_TI]  37.59,16.89 90 top
C96  220nF  [C0402_TI]  38.28,31.22 90 bottom
C97  220nF  [C0402_TI]  43.46,22.99 0 bottom
C98  220nF  [C0402_TI]  41.91,23.5 90 bottom
C99  220nF  [C0402_TI]  40.94,23.5 90 bottom
C100  220nF  [C0402_TI]  35.28,23.5 90 bottom
C101  100nF  [C0402_TI]  61.85,14.35 270 top
C102  100nF  [C0402_TI]  65.02,9.14 0 top
C103  100nF  [C0402_TI]  65.02,10.29 0 top
C104  27pF  [C0603_DWS]  51.31,18.67 270 bottom
C105  27pF  [C0603_DWS]  59.06,19.05 270 bottom
C106  220nF  [C0402_TI]  33.86,23.95 0 bottom
C107  220nF  [C0402_TI]  33.86,22.99 0 bottom
C108  1uF  [C0603_DWS]  37.47,15.11 180 top
C109  100nF  [C0402_TI]  36.13,16.32 180 top
C110  10pF  [C0402_TI]  45.34,16 0 bottom
C111  100nF  [C0402_TI]  56.64,11.56 180 top
C112  NA(100nF)  [C0402_TI]  18.41,41.27 180 top
C113  NA(100nF)  [C0402_TI]  20.7,41.27 0 top
C114  NA(100nF)  [C0402_TI]  20.19,18.41 0 top
C115  10pF  [C0402_TI]  43.31,16 180 bottom
C116  33pF  [C0603_DWS]  27.81,20.7 0 bottom
C117  33pF  [C0603_DWS]  24.26,20.7 180 bottom
C118  22uF/6.3V  [C0603_DWS]  50.93,18.67 90 top
C119  100nF  [C0402_TI]  43.36,25.93 0 bottom
C120  22uF/6.3V  [C0603_DWS]  31.62,41.02 180 top
C121  220nF  [C0402_TI]  34.01,30.43 180 bottom
C122  22uF/6.3V  [C0603_DWS]  16.38,7.75 0 bottom
C123  22uF/6.3V  [C0603_DWS]  30.05,29.89 270 bottom
C124  22uF/6.3V  [C0603_DWS]  16.38,9.27 0 bottom
C125  1uF  [C0603_DWS]  26.54,44.7 180 bottom
C126  220nF  [C0402_TI]  26.54,42.61 180 bottom
C127  10uF/6.3V  [C0603_DWS]  25.91,41.27 0 top
C128  10uF/6.3V  [C0603_DWS]  25.91,44.32 0 top
C129  220nF  [C0402_TI]  26.54,43.5 180 bottom
C130  220nF  [C0402_TI]  20.07,21.84 180 bottom
C131  220nF  [C0402_TI]  20.07,20.95 180 bottom
C132  220nF  [C0402_TI]  33.15,39.24 270 top
C133  220nF  [C0402_TI]  34.04,39.24 270 top
C134  10uF/6.3V  [C0603_DWS]  35.56,39.37 270 bottom
C135  100nF  [C0402_TI]  26.8,12.45 270 bottom
C136  100nF  [C0402_TI]  18.41,13.84 180 bottom
C137  100nF  [C0402_TI]  18.92,11.56 270 bottom
C138  22uF/6.3V  [C0603_DWS]  22.48,13.84 0 bottom
C139  1nF  [C0402_TI]  55.88,54.61 90 bottom
C140  1nF  [C0402_TI]  55.88,58.42 270 bottom
C141  1nF  [C0402_TI]  57.15,54.61 90 bottom
C142  1nF  [C0402_TI]  57.15,58.42 270 bottom
C143  22uF/6.3V  [C0603_DWS]  19.69,19.68 180 bottom
C144  220nF  [C0402_TI]  33.86,26.8 180 bottom
C145  22uF/6.3V  [C0603_DWS]  50.67,42.67 90 top
C146  10uF/6.3V  [C0603_DWS]  78.36,28.45 0 bottom
C147  22uF/6.3V  [C0603_DWS]  78.36,30.35 180 bottom
C148  220nF  [C0402_TI]  33.86,25.83 180 bottom
C149  100nF  [C0402_TI]  77.47,33.66 270 bottom
C150  10uF/6.3V  [C0603_DWS]  78.36,20.32 0 bottom
C151  22uF/6.3V  [C0603_DWS]  78.36,22.22 180 bottom
C152  100nF  [C0402_TI]  77.47,26.54 90 bottom
C153  10nF  [C0402_TI]  8.64,40.13 0 bottom
C154  10nF  [C0402_TI]  8.64,41.02 0 bottom
C155  10uF/6.3V  [C0603_DWS]  71.37,39.5 0 bottom
C156  10nF  [C0402_TI]  8.64,43.94 0 bottom
C157  10nF  [C0402_TI]  8.64,44.83 0 bottom
C158  10uF/6.3V  [C0603_DWS]  65.66,39.37 180 bottom
C159  1uF  [C0603_DWS]  72.9,46.23 0 bottom
C160  10uF/6.3V  [C0603_DWS]  75.31,41.66 270 top
C161  10uF/6.3V  [C0603_DWS]  72.9,47.75 180 bottom
C162  10uF/6.3V  [C0603_DWS]  69.98,48.13 90 bottom
C163  10uF/6.3V  [C0603_DWS]  65.15,42.93 270 bottom
C164  220nF  [C0402_TI]  37.39,33.1 90 bottom
C165  22uF/6.3V  [C0603_DWS]  43.81,41.02 0 bottom
C166  10uF/6.3V  [C0603_DWS]  53.09,50.04 90 top
C167  1nF  [C0402_TI]  54.36,50.42 90 top
C168  22uF/6.3V  [C0603_DWS]  7.49,54.99 90 bottom
C169  NA(22uF/6.3V)  [C0603_DWS]  5.97,54.99 90 bottom
C170  10uF/6.3V  [C0603_DWS]  66.93,51.18 0 top
C171  1uF  [C0603_DWS]  58.93,41.53 90 bottom
C172  10uF/6.3V  [C0603_DWS]  53.47,44.45 90 top
C173  1nF  [C0402_TI]  52.2,44.45 90 top
C174  10uF/6.3V  [C0603_DWS]  60.2,49.02 90 bottom
C175  22uF/6.3V  [C0603_DWS]  7.49,51.69 90 bottom
C176  1uF  [C0603_DWS]  62.1,42.93 270 bottom
C177  22uF/6.3V  [C0603_DWS]  24.77,37.21 0 bottom
C178  220nF  [C0402_TI]  33.86,29.54 180 bottom
C179  10uF/6.3V  [C0603_DWS]  63.63,42.93 90 bottom
C180  1uF  [C0603_DWS]  59.56,40.83 0 top
C181  22uF/6.3V  [C0603_DWS]  49.15,42.67 90 top
C182  10uF/6.3V  [C0603_DWS]  60.45,41.53 90 bottom
C183  10uF/6.3V  [C0603_DWS]  58.67,49.02 90 bottom
C184  220nF  [C0402_TI]  33.86,28.58 180 bottom
C185  10uF/6.3V  [C0603_DWS]  71.88,42.55 0 top
C186  10uF/6.3V  [C0603_DWS]  71.88,41.02 0 top
C187  1nF  [C0402_TI]  69.98,48.64 270 top
C188  10uF/6.3V  [C0603_DWS]  56.52,49.02 90 bottom
C189  220nF  [C0402_TI]  33.63,33.1 270 bottom
C190  22uF/6.3V  [C0603_DWS]  24.77,35.69 0 bottom
C191  22uF/6.3V  [C0603_DWS]  19.43,50.55 0 top
C192  22uF/6.3V  [C0603_DWS]  19.69,43.69 180 top
C193  100nF  [C0402_TI]  20.07,44.96 180 top
C194  220nF  [C0402_TI]  35.51,33.1 270 bottom
C195  22uF/6.3V  [C0603_DWS]  35.18,44.07 0 top
C196  220nF  [C0402_TI]  34.57,33.1 270 bottom
C197  470nF  [C0603_DWS]  35.18,42.55 0 top
C198  22uF/6.3V  [C0603_DWS]  31.62,42.55 180 top
C199  470nF  [C0603_DWS]  35.18,41.02 0 top
C200  470uF/10V/105C  [E2,5-6,3]  69.09,56.13 90 top
C201  22pF  [C0603_DWS]  46.74,45.72 270 bottom
C202  22uF/6.3V  [C0603_DWS]  54.36,41.47 90 bottom
C203  22uF/6.3V  [C0603_DWS]  51.82,45.72 270 bottom
C204  22uF/6.3V  [C0603_DWS]  53.34,45.72 270 bottom
C205  22uF/6.3V  [C0603_DWS]  77.72,42.55 180 bottom
C206  22uF/6.3V  [C0603_DWS]  77.72,41.02 180 bottom
C207  22uF/6.3V  [C0603_DWS]  80.14,43.43 270 bottom
C208  22uF/6.3V  [C0603_DWS]  77.22,48.39 180 bottom
C209  1nF  [C0402_TI]  24.51,51.05 180 bottom
C210  22uF/6.3V  [C0603_DWS]  31.75,52.96 90 bottom
C211  22pF  [C0603_DWS]  25.78,57.78 270 top
C212  22uF/6.3V  [C0603_DWS]  27.3,57.78 270 bottom
C213  22uF/6.3V  [C0603_DWS]  25.78,57.78 270 bottom
C214  1nF/2kV/X7R/1206  [C1206_5MILS_WS_ISO]  70.36,20.07 180 bottom
C215  NA(47uF/6.3V/tant)  [CT3528_MIL]  72.14,30.86 0 top
C216  NA(47uF/6.3V/tant)  [CT3528_MIL]  72.14,30.86 180 bottom
C217  NA(47uF/6.3V/tant)  [CT3528_MIL]  80.39,21.59 180 top
C218  NA(47uF/6.3V/tant)  [CT3528_MIL]  80.39,30.86 180 top
C219  NA(47uF/6.3V/tant)  [CT3528_MIL]  22.73,13.84 180 top
C220  NA(22uF/6.3V)  [C0603_DWS]  72.14,33.66 180 bottom
C221  NA(22uF/6.3V)  [C0603_DWS]  73.66,23.24 90 bottom
C222  NA(22uF/6.3V)  [C0603_DWS]  72.14,23.24 90 bottom
C223  NA(22uF/6.3V)  [C0603_DWS]  70.61,23.24 90 bottom
C224  47uF/6.3V  [C0805_5MIL_DWS]  6.22,54.23 90 top
C225  NA(22uF/6.3V)  [C0603_DWS]  17.27,35.43 270 bottom
C226  NA(2.2uF)  [C0603_DWS]  18.8,35.43 90 bottom
C227  NA(100nF)  [C0402_TI]  20.65,32.69 180 bottom
C228  NA(100nF)  [C0402_TI]  23.85,26.59 180 bottom
C229  NA(2.2uF)  [C0603_DWS]  19.35,28.79 0 bottom
C230  NA(100nF)  [C0402_TI]  20.83,35.05 90 bottom
C231  NA(2.2uF)  [C0603_DWS]  22.35,35.69 270 bottom
C232  47uF/6.3V  [C0805_5MIL_DWS]  8.26,54.23 90 top
CHGLED  LED/YELLOW/0603  [LED-0603]  77.85,41.02 180 top
D1  1N5819(S4SOD-123)  [SOD-123]  52.45,52.96 0 bottom
D2  1N5819(S4SOD-123)  [SOD-123]  68.96,3.56 0 bottom
D3  SMBJ6.0A  [DO214AA]  77.6,52.32 90 bottom
D4  NA(1N5822/SS34/SMA)  [MLL-41]  77.6,58.29 0 bottom
D5  1N5822/SS34/SMA  [MELF-MLL41]  80.39,38.73 180 bottom
EMMC  NA(GPH127SMT-02X5(PA-V16X-2X5-LF))  [GPH127SMT-02X05(PA-V16X-2X5-LF)]  4.45,23.88 270 bottom
EMMC_PWR  (1-2:Soldered/2-3:Opened)  [SJ_2_SMALLER]  13.46,36.7 270 bottom
FET1  IRLML6402  [SOT23]  10.29,57.28 270 bottom
FET2  BSS138  [SOT23]  71.88,53.34 270 bottom
FET3  IRLML6402  [SOT23]  71.88,57.4 0 bottom
FET4  IRLML6402  [SOT23]  71.5,51.31 90 top
FUSE1  FSMD035  [1206]  11.43,33.53 270 bottom
GND  TESTPADTESTPAD_40-ROUND  [TESTPAD_40-ROUND]  17.27,58.67 0 bottom
GND_PIN  TESTPAD3  [TEST_PAD40/70/SQUARE]  26.16,1.27 0 top
GPIO-1  GPH127SMT-02X20(PA-V16X-2X20-LF)  [GPH127SMT-02X20(PA-V16X-2X20-LF)]  38.1,50.16 0 top
GPIO-2  GPH127SMT-02X20(PA-V16X-2X20-LF)  [GPH127SMT-02X20(PA-V16X-2X20-LF)]  38.1,9.52 0 top
GPIO-3  GPH127SMT-02X20(PA-V16X-2X20-LF)  [GPH127SMT-02X20(PA-V16X-2X20-LF)]  45.08,3.17 0 top
GPIO-4  GPH127SMT-02X10(PA-V16X-2X10-LF)  [GPH127SMT-02X10(PA-V16X-2X10-LF)]  14.86,53.09 90 top
HDMI  HDMI-SWM-19  [HDMI-SWM-19]  4.19,25.27 90 top
IPSOUT  TESTPADTESTPAD_40-ROUND  [TESTPAD_40-ROUND]  58.8,45.59 0 bottom
L1  0R/0805  [L0805_5MIL_DWS]  63.63,15.37 270 top
L2  0R/0805  [L0805_5MIL_DWS]  53.34,11.81 0 top
L3  0R/0805  [L0805_5MIL_DWS]  60.58,16.38 180 top
L4  4.7uH/1.15A/DCR<0.1R/CD43  [CD42(43)]  62.36,17.65 90 bottom
L5  CL470nH/0805/0.3R/250mA  [L0805_5MIL_DWS]  16.13,5.21 0 bottom
L6  FB0805/600R/2A  [L0805_5MIL_DWS]  19.94,15.62 180 bottom
L7  FB0805/600R/2A  [L0805_5MIL_DWS]  9.4,3.17 270 top
L8  FB0805/600R/2A  [L0805_5MIL_DWS]  78.99,33.15 90 bottom
L9  FB0805/600R/2A  [L0805_5MIL_DWS]  71.78,27.84 0 bottom
L10  FB0805/600R/2A  [L0805_5MIL_DWS]  78.99,25.02 90 bottom
L11  2.2uH/1.5A/DCR<0.1R/CD32  [CD32]  72.39,46.23 270 top
L12  2.2uH/1.5A/DCR<0.1R/CD32  [CD32]  56.77,50.93 270 top
L13  2.2uH/1.5A/DCR<0.1R/CD32  [CD32]  56.26,45.21 270 top
L14  2.2uH/1.5A/DCR<0.1R/CD32  [CD32]  56.13,45.21 90 bottom
L15  2.2uH/1.5A/DCR<0.1R/CD32  [CD32]  81.41,47.37 270 bottom
L16  2.2uH/1.5A/DCR<0.1R/CD32  [CD32]  30.35,57.4 0 bottom
L17  NA(FB0805/600R/2A)  [L0805_5MIL_DWS]  15.49,35.43 270 bottom
LAN  TM211Q01FM22_SH  [TM211Q01FM22_SH]  76.96,12.06 270 top
LCD_CON  GPH127SMT-02X20(PA-V16X-2X20-LF)  [GPH127SMT-02X20(PA-V16X-2X20-LF)]  45.08,56.52 0 top
LED1  LED/GREEN/0603  [LED-0603]  28.7,2.16 90 top
LIPO_BAT  DW02R  [DW02R]  81.53,43.43 90 top
NAND_E  Closed  [SJ_1_SMALLER_CLOSE_10MILS]  20.57,37.72 0 bottom
PC3/PB8  PC3:Closed/PB8:Opened  [SJ_2_SMALL_23_TIED]  10.29,47.24 180 bottom
PWR  SIDE_WTCM-TR(3X4)  [SW_TAKT3X4]  1.27,54.36 270 bottom
PWR_JACK  PWRJ-2mm(YDJ-1136)  [PWR_JACK_UNI_MILLING]  74.3,56.64 180 top
PWR_LED  LED/RED/0603  [LED-0603]  78.61,58.55 180 top
Q1  E4SB25.000F20E15(25MHz/20pF/20ppm/5x3.2mm)  [HCX-4S]  55.25,18.86 0 bottom
Q2  32768Hz/6pF  [MC-306]  43.43,10.29 270 bottom
Q3  4SB24.000F20E15/5x3.2mm/20ppm/20pF  [HCX-4S]  26.16,23.37 180 bottom
R1  2k/1%  [R0402_TI]  64.77,18.8 0 top
R2  2k/1%  [R0402_TI]  55.96,18.29 90 top
R3  NA  [R0402_TI]  57.39,18.81 180 top
R4  2k/1%  [R0402_TI]  63.31,18.41 90 top
R5  2k/1%  [R0402_TI]  53.29,18.29 270 top
R6  2k/1%  [R0402_TI]  46.36,37.85 0 bottom
R7  330R/1%  [R0603_5MIL_DWS]  63.65,35.49 0 bottom
R8  330R/1%  [R0603_5MIL_DWS]  62.25,24.19 0 bottom
R9  22R  [R0402_TI]  50.29,32.89 180 top
R10  22R  [R0402_TI]  50.29,33.78 180 top
R11  0R(Board_Mounted)  [R0402_TI_0R]  46.36,36.96 0 bottom
R12  NA(4.7k)  [R0402_TI]  58.17,2.41 270 bottom
R13  0R(Board_Mounted)  [R0402_TI_0R]  46.36,36.07 0 bottom
R14  330R/1%  [R0603_5MIL_DWS]  43.81,39.5 0 bottom
R15  10k  [R0402_TI]  60.58,10.67 90 top
R16  22R  [R0402_TI]  61.47,10.67 90 top
R17  22R  [R0402_TI]  56.52,9.72 0 top
R18  10k  [R0402_TI]  54.67,13.84 90 top
R19  NA  [R0402_TI]  54.55,16.32 270 top
R20  1k  [R0402_TI]  78.36,2.41 90 top
R21  4.7k  [R0402_TI]  79.25,2.41 270 top
R22  NA(10k)  [R0402_TI]  22.73,41.27 0 top
R23  NA(10k)  [R0402_TI]  21.72,42.16 0 top
R24  1k  [R0402_TI]  56.64,13.34 0 top
R25  NA(22R)  [R0402_TI]  56.64,14.22 180 top
R26  2.49k/1%  [R0603_5MIL_DWS]  59.69,12.45 180 top
R27  47k  [R0402_TI]  54.61,55.12 270 bottom
R28  NA  [R0402_TI]  15.88,37.97 0 bottom
R29  NA(10k)  [R0402_TI]  18.41,42.16 180 top
R30  47k  [R0402_TI]  36.13,17.21 0 top
R31  470k  [R0402_TI]  54.93,9.78 270 top
R32  4.7k  [R0402_TI]  80.01,17.4 0 bottom
R33  NA  [R0402_TI]  53.66,16.32 90 top
R34  NA  [R0402_TI]  56.64,10.67 180 top
R35  10M  [R0402_TI]  44.32,16.89 0 bottom
R36  1k  [R0402_TI]  82.04,17.4 0 bottom
R37  4.7k  [R0402_TI]  52.2,15.75 180 top
R38  NA  [R0402_TI]  56.64,12.45 180 top
R39  NA(2.2k)  [R0402_TI]  46.86,2.29 90 bottom
R40  NA(2.2k)  [R0402_TI]  45.72,2.29 270 bottom
R41  100k/1%  [R0603_5MIL_DWS]  16.38,12.32 180 bottom
R42  10k  [R0402_TI]  16.38,10.54 180 bottom
R43  200k/1%  [R0603_5MIL_DWS]  25.91,42.8 180 top
R44  10k  [R0402_TI]  5.84,17.91 90 bottom
R45  2k/1%  [R0402_TI]  12.83,32.13 90 top
R46  2k/1%  [R0402_TI]  11.94,32.13 90 top
R47  47k  [R0402_TI]  12.32,28.58 270 bottom
R48  NA(0R)  [R0603_5MIL_DWS]  42.61,40.39 90 top
R49  NA  [R0603_5MIL_DWS]  51.82,56.39 0 bottom
R50  NA  [R0603_5MIL_DWS]  52.45,54.86 0 bottom
R51  4.99k/1%  [R0603_5MIL_DWS]  23.62,15.49 0 bottom
R52  10k  [R0402_TI]  21.08,9.14 0 bottom
R53  13k/1%  [R0603_5MIL_DWS]  24.51,9.91 270 bottom
R54  10k  [R0402_TI]  25.91,12.45 90 bottom
R55  47k  [R0402_TI]  10.92,3.17 90 top
R56  2.2k  [R0402_TI]  44.58,45.72 270 bottom
R57  2.2k  [R0402_TI]  45.47,45.72 270 bottom
R58  10k  [R0402_TI]  82.04,28.45 180 bottom
R59  6.8k/1%  [R0603_5MIL_DWS]  81.79,34.29 180 bottom
R60  2.2k  [R0402_TI]  52.07,48.51 270 bottom
R61  2.2k  [R0402_TI]  51.18,48.51 270 bottom
R62  10k  [R0402_TI]  82.04,20.57 180 bottom
R63  13k/1%  [R0603_5MIL_DWS]  81.79,26.16 180 bottom
R64  10k  [R0402_TI]  75.06,1.91 0 top
R65  100R  [R0603_5MIL_DWS]  71.88,39.5 180 top
R66  0.03R/1%  [R1206_5MIL_WS]  72.64,42.93 90 bottom
R67  100k/1%  [R0603_5MIL_DWS]  82.68,54.99 270 bottom
R68  10k  [R0402_TI]  10.29,54.48 180 bottom
R69  200k/1%  [R0603_5MIL_DWS]  82.68,51.18 270 bottom
R70  2.2k  [R0402_TI]  77.47,42.29 180 top
R71  10k  [R0402_TI]  9.78,48.89 180 bottom
R72  191R/1%  [R0603_5MIL_DWS]  25.91,41.4 180 bottom
R73  6.8k/1%  [R0603_5MIL_DWS]  5.97,51.69 270 bottom
R74  200k/1%  [R0603_5MIL_DWS]  59.56,42.35 0 top
R75  2.2k  [R0402_TI]  69.09,48.64 270 top
R76  47k  [R0402_TI]  68.07,58.93 180 bottom
R77  2.2k  [R0402_TI]  66.93,49.91 180 top
R78  10k  [R0402_TI]  72.52,50.16 0 bottom
R79  2.2k  [R0402_TI]  67.18,51.18 90 bottom
R80  2.2k  [R0402_TI]  62.74,40.32 0 bottom
R81  2.2k  [R0402_TI]  68.07,51.18 90 bottom
R82  2.2k  [R0402_TI]  75.82,58.55 0 top
R83  0R(Board_Mounted)  [0603_0R]  66.8,56.77 270 bottom
R84  1M  [R0402_TI]  74.17,49.02 0 bottom
R85  8.25k/1%  [R0603_5MIL_DWS]  75.31,41.66 270 bottom
R86  4.99k/1%  [R0603_5MIL_DWS]  48.77,45.72 270 bottom
R87  100k/1%  [R0603_5MIL_DWS]  23.88,49.78 180 bottom
R88  2.2k  [R0402_TI]  29.97,2.54 90 top
R89  1.1k/1%  [R0603_5MIL_DWS]  75.31,45.97 90 bottom
R90  3.32k/1%  [R0603_5MIL_DWS]  47.88,43.31 0 bottom
R91  4.99k/1%  [R0603_5MIL_DWS]  27.3,57.78 270 top
R92  1.1k/1%  [R0603_5MIL_DWS]  26.92,53.72 90 bottom
R93  NA(2.2k)  [R0402_TI]  30.61,12.32 270 bottom
R94  NA(2.2k)  [R0402_TI]  31.88,12.32 270 bottom
R95  NA(2.2k)  [R0402_TI]  32.77,12.32 270 bottom
R96  NA(2.2k)  [R0402_TI]  29.72,12.32 270 bottom
R97  NA(10k)  [R0402_TI]  21.85,26.59 180 bottom
R98  NA(10k)  [R0402_TI]  19.85,26.59 0 bottom
R99  NA(22R)  [R0402_TI]  22.05,24.39 270 bottom
R101  NA(22R)  [R0402_TI]  18.54,37.59 0 bottom
R102  NA(22R)  [R0402_TI]  20.95,24.69 90 bottom
RECOVERY  SIDE_WTCM-TR(3X4)  [SW_TAKT3X4]  1.27,37.85 270 bottom
RESET  SIDE_WTCM-TR(3X4)  [SW_TAKT3X4]  1.27,46.1 270 bottom
RM1  RA0805_(4X0402)_4B8_4.7k  [R_MATRIX_4_0402_25X625]  57.28,5.21 180 bottom
RM2  RA0805_(4X0402)_4B8_22R  [R_MATRIX_4_0402_25X625]  57.28,7.75 0 top
RM3  RA1206_(4X0603)_4B8_100K  [R_MATRIX_4]  16.38,2.16 270 bottom
RM4  RA0805_(4X0402)_4B8_4.7k  [R_MATRIX_4_0402_25X625]  49.78,2.67 180 bottom
RM5  NA(RA1206_(4X0603)_4B8_10k)  [R_MATRIX_4]  16.64,23.88 180 bottom
RM6  NA(RA1206_(4X0603)_4B8_10k)  [R_MATRIX_4]  24,29.46 0 bottom
RM7  NA(RA0805_(4X0402)_22R)  [R_MATRIX_4_0402_25X625]  16.13,19.94 0 bottom
RM8  NA(RA0805_(4X0402)_22R)  [R_MATRIX_4_0402_25X625]  27.94,16.89 90 bottom
SATA  SATA-PWA-07  [SATA-PWA-07]  3.98,42.91 90 top
SD/MMC  TFC-WPAPR-08  [TFC-WPAPR-08]  5.45,8.63 0 bottom
T1  BC846B  [SOT23]  10.29,51.69 0 bottom
U1  A20  [TFBGA441]  38.65,28.29 90 top
U2  K4B4G1646D-BCK0  [FBGA96_SK]  59.05,35.19 0 top
U3  K4B4G1646D-BCK0  [FBGA96_SK]  59.05,24.29 0 top
U4  NA(H27UBG8T2BTR)  [TSOP48]  20.19,29.84 270 top
U5  RTL8211CL-GR  [LQFP48]  56.26,11.94 270 bottom
U6  AT24C16BN-SH  [SO-08MN]  37.85,4.83 180 bottom
U7  NA(RCLAMP0524P)  [SLP2510P8]  12.06,22.35 90 top
U8  NA(RCLAMP0524P)  [SLP2510P8]  12.06,25.4 90 top
U9  NA(RCLAMP0524P)  [SLP2510P8]  12.06,28.32 90 top
U10  SY6280  [SOT23-5]  21.46,11.43 180 bottom
U11  SY6280  [SOT23-5]  81.53,31.37 90 bottom
U12  SY6280  [SOT23-5]  81.53,23.24 90 bottom
U13  AXP209(QFN48)  [QFN48]  65.15,44.96 180 top
U14  MCP120T475I-TT  [SOT23]  76.71,45.28 180 top
U15  SY8009AAAC(SOT23-5)  [SOT23-5]  51.82,41.91 90 bottom
U16  SY7208(SOT23-6)  [SOT23-6]  77.72,45.47 270 bottom
U17  SY8009AAAC(SOT23-5)  [SOT23-5]  29.34,52.32 90 bottom
U18  FIDUCIAL  [FIDUCIAL-1X3]  10.41,56.64 180 top
U19  FIDUCIAL  [FIDUCIAL-1X3]  81.28,1.4 180 top
U20  FIDUCIAL  [FIDUCIAL-1X3]  8.89,37.59 0 bottom
U21  FIDUCIAL  [FIDUCIAL-1X3]  81.53,2.67 0 bottom
U23  NA(MTFC4GACAANA-4M_IT)  [TBGA100]  20.95,30.19 270 top
U$2  [HAMMOND_1593LBK_A10_LIME]  0,0 0 top
U$5  [LOGO-OPENHARDWARE_8X8]  34.92,18.41 0 bottom
U$6  [OLIMEX1_V]  47.5,26.42 0 bottom
U$9  [PB]  75.06,11.81 0 bottom
U$10  [ESD_SYMBOL]  34.42,0.51 0 bottom
U$11  [RECYCLE_BIN1/8]  83.31,9.02 0 bottom
U$12  [ROHS]  36.32,42.04 90 bottom
UART0  HN1X3  [HN1X3]  69.85,1.52 0 top
USB_HOST1  USB_A_VERTICAL  [USB_A_VERTICAL_PTH]  87.88,32.26 90 top
USB_HOST2  USB_A_VERTICAL  [USB_A_VERTICAL_PTH]  87.88,22.61 90 top
USB_OTG  USB-OTG  [USB_MINI_9PIN]  1.52,7.63 180 top
VR1  AP1231-2.5V(SOT23-5)  [SOT-23-5]  19.94,47.62 90 top

## Tracks (layer width: path | path; a pad name or v marks a point on that pad's centre or on a via)
5VEXT  (via drill 0.6)
  Top 0.203: U13.32 65.75,41 65.96,41 66.15,41 U13.33
  Top 0.508: 74.3,54.86 74.55,55.12 74.55,57.78 R82.1 | U14.2 75.86,44.07 78.61,44.07 78.99,44.45 78.99,46.99 75.95,50.04 74.3,50.04 PWR_JACK.+
  Top 0.61: v66.22,40.26 65.96,40.51 65.96,41
  Top 1.016: PWR_JACK.+ 74.3,54.86
  Route3 1.524: PWR_JACK.+ 74.3,53.34 73.53,54.1 69.85,54.1 C200.+
  Route14 0.813: v66.22,40.26 66.22,41.2
  Route14 1.016: 66.22,41.2 66.22,41.71 68.58,44.07 68.58,46.23 69.85,47.5 72.77,47.5 74.3,49.02 PWR_JACK.+
  Bottom 0.254: C200.+ 68.2,54.86 65.79,52.45 5VEXT.1
  Bottom 0.508: 69.34,53.34 5V_E.1
  Bottom 0.61: 74.3,50.42 74.04,50.16 R78.1
  Bottom 0.762: C200.+ 69.34,54.61 69.34,53.34 | C158.2 66.22,39.7 v66.22,40.26
  Bottom 1.016: D3.C 77.6,50.42 74.3,50.42 PWR_JACK.+ 74.3,57.4 | D4.A 75.06,58.29 74.3,57.53 74.3,57.4 | 74.3,57.4 FET3.3
+5V  (via drill 0.4, 0.6)
  Top 0.508: v26.03,49.4 GPIO-1.1
  Top 0.61: 11.94,32.89 R46.2 R45.2 | v33.02,55.75 LCD_CON.1
  Top 0.762: v26.03,8.76 GPIO-2.1 | v33.02,2.41 GPIO-3.1
  Top 0.889: v69.47,51.44 70.44,52.41 FET4.2
  Top 1.016: 11.94,32.89 11.43,33.4 v11.43,36.19 v11.43,37.08
  Route3 1.016: v81.41,58.29 70.87,58.29 70.23,58.93 v69.6,58.93
  Route4 1.016: v69.6,58.93 70.23,58.93 70.61,58.55 70.61,52.58 v69.47,51.44
  Route13 0.508: 18.29,11.81 v18.29,12.06 | 18.92,11.81 19.18,11.81 v19.18,12.7
  Route13 0.762: 32.77,2.41 v33.02,2.41 | 25.4,8.76 v26.03,8.76
  Route13 1.016: 32.77,2.41 32.51,2.67 30.35,2.67 28.07,4.95 28.07,6.1 25.4,8.76 23.11,11.05 19.94,11.05 19.18,11.81 | 68.71,51.44 68.71,49.78 80.26,38.23 80.26,34.54 81.53,33.27 81.53,30.99 80.26,29.72 v80.26,28.45 | 33.02,54.23 v33.02,55.75 | 33.02,54.23 31.5,52.7 25.53,52.7 24,51.18 | 24,51.18 22.35,49.53 19.94,49.53 16.64,46.23 13.34,46.23 12.83,46.74 8.64,46.74 | 8.64,46.74 8.64,39.37 10.92,37.08 v11.43,37.08 v11.43,36.19 11.43,32.51 9.91,30.99 7.37,30.99 6.1,29.72 6.1,14.73 9.52,11.3 12.57,11.3 13.59,12.32 16.26,12.32 16.76,11.81 18.29,11.81 18.92,11.81 | 8.64,46.74 v8.64,57.53 | 33.02,54.23 55.88,54.23 59.56,50.55 63.75,50.55 64.14,50.93 64.64,50.93 65.15,51.44 68.71,51.44 | 68.71,51.44 v69.47,51.44 | v26.03,49.4 25.78,49.4 24,51.18
  Route14 1.016: v80.26,28.45 80.26,26.42 78.99,25.15 78.99,21.59 v80.52,20.07
  Bottom 0.254: FUSE1.1 +5V.1
  Bottom 0.508: 80.01,28.45 80.01,29.34 80.39,29.72 80.58,29.72 U11.5 | v80.52,20.07 80.58,20.13 U12.5 | 8,57.53 5V_E_SATA.1 | U10.5 19.49,12.38 19.18,12.06 | v18.29,12.06 C137.1 19.18,12.06 | 19.18,12.06 v19.18,12.7 | 69.34,52.32 5V_E.2 | v69.6,58.93 R76.2
  Bottom 0.61: FET1.2 9.78,55.73 R68.1
  Bottom 0.762: 8,57.53 v8.64,57.53 9.34,56.83 FET1.2 | v69.47,51.44 69.34,51.56 69.34,52.32
  Bottom 1.016: v80.52,20.07 80.52,20.32 C150.1 | v80.26,28.45 80.01,28.45 C146.1 | v11.43,36.19 v11.43,37.08 | FET3.2 70.21,58.93 v69.6,58.93 | v81.41,58.29 D4.K
  Bottom 1.524: v11.43,36.19 FUSE1.1
+5V_OTG_PWR  (via drill 0.4, 0.6)
  Top 0.203: U13.31 65.35,41.3 65.1,41.05
  Top 0.508: v65.1,40.41 v65.1,41.02 65.1,41.05 | USB_OTG.VBUS 7.07,9.52 7.62,9.52
  Top 1.016: 7.62,9.52 8.89,9.52 11.68,12.32 v11.68,13.46
  Route4 0.635: v65.1,40.41 65.1,40.91 65.28,41.08
  Route4 1.016: v82.68,56.9 82.04,56.9 79.12,53.97 79.12,50.8 75.95,47.62 69.98,47.62 68.58,46.23 68.58,44.39 65.28,41.08
  Route13 0.61: v65.1,40.41 v65.1,41.02 65.1,41.45 65.02,41.53 65.02,41.66 64.9,41.78
  Route13 1.016: 64.9,41.78 64.64,42.04 59.44,42.04 58.42,43.05 51.05,43.05 48.13,40.13 42.55,40.13 40.89,41.78 37.08,41.78 35.81,40.51 34.29,40.51 33.66,39.88 15.62,39.88 14.6,38.86 14.6,33.15 10.92,29.46 10.92,14.22 v11.68,13.46
  Bottom 0.61: v65.1,40.41 v65.1,41.02 65.15,41.02 | 17.78,13.97 C136.1
  Bottom 0.762: 13.08,13.46 17.27,13.46 17.78,13.97 17.78,14.48 L6.1
  Bottom 0.813: 65.15,41.02 C163.2
  Bottom 1.016: v11.68,13.46 13.08,13.46 | v82.68,56.9 R67.1
+24V  (via drill 0.4, 0.6)
  Top 0.203: U13.38 68.91,43.16 68.91,43.36 68.91,43.56 U13.39 | v70.1,44.45 69.85,44.45 69.54,44.76 U13.42
  Top 0.61: 68.91,43.36 v69.16,43.1 v69.16,42.56
  Route3 1.016: v72.52,48.89 72.52,48.01 78.11,42.42 81.55,42.42 LIPO_BAT.1
  PWR 0.508: v69.16,42.56 69.16,43.13
  Bottom 0.254: v69.16,42.56 70.22,42.56 BAT.1
  Bottom 0.61: v69.16,42.56 69.16,42.67 | v72.52,48.89 72.52,49.02
  Bottom 0.813: 69.16,42.67 v69.16,43.1 69.16,43.51 v70.1,44.45 70.48,44.83 72.01,44.83
  Bottom 1.016: R66.2 72.2,44.83 72.01,44.83 C159.2 C161.1 72.01,48.01 72.52,48.51 v72.52,48.89 | LIPO_BAT.1 80.25,42.43 C207.2
AVDD1  (via drill 0.3, 0.4)
  Top 0.381: v55.88,14.92 55.88,15.11 56.33,15.56 C72.2
  Top 0.508: C73.2 63.12,11.81 62.86,12.06
  Top 0.762: 62.61,11.81 62.48,11.68 v62.36,11.68
  Top 1.016: L1.2 63.37,14.1 C71.2 62.86,12.06 62.61,11.81
  Route14 0.508: v55.88,14.92 55.88,15.24 56.01,15.37
  Route14 0.635: 56.01,15.37 56.52,15.88 59.69,15.88 60.33,15.24 60.33,13.72 v62.36,11.68
  Bottom 0.254: U5.6 61.34,12.19 61.85,11.68 v62.36,11.68 | U5.41 55.51,15.48 55.88,15.11 v55.88,14.92
AVDD/DVDD(1.05V)  (via drill 0.3, 0.4, 0.6)
  Top 0.381: C89.2 55.44,15.56 55.25,15.37 v55.25,14.92
  Top 0.508: C90.2 52.58,10.03 v53.15,10.6 | C101.2 62.36,13.34 v62.36,13.21 | C88.2 62.36,9.27 v62.36,9.91
  Route13 0.508: 55.25,16.26 v55.25,14.92 | 50.93,15.49 v50.61,15.18 | 62.1,10.16 v62.36,9.91
  Route13 0.762: v53.15,10.6 52.2,11.56 52.2,11.81
  Route13 1.016: 64.14,16.76 64.39,16.76 64.64,17.02 v65.41,17.02 | 52.2,15.49 50.93,15.49 | 52.2,15.49 53.09,15.49 53.85,16.26 53.97,16.26 | 52.2,11.81 52.2,15.49 | v62.36,13.21 61.34,12.19 61.34,10.92 62.1,10.16
  Route13 1.524: 62.36,16.26 v62.36,13.21 | 62.36,16.26 62.86,16.76 64.14,16.76 | 53.97,16.26 55.25,16.26 62.36,16.26
  Bottom 0.254: U5.3 61.69,13.69 62.17,13.21 v62.36,13.21 | v55.25,14.92 55.25,15.11 55.01,15.35 U5.40 | v53.15,10.6 53.07,10.69 U5.28 | v62.36,9.91 62.23,9.91 61.95,10.19 U5.10 | U5.36 51.73,14.69 51.59,14.83 51.33,14.83
  Bottom 0.406: v50.61,15.18 50.8,15.18 50.8,15.24 C91.2
  Bottom 0.508: 51.33,14.83 50.93,15.24 50.8,15.24
  Bottom 1.016: v65.41,17.02 C87.2 | C87.2 62.56,19.05 L4.2 | C87.2 C86.2
BA0  (via drill 0.25)
  Top 0.127: v62.25,33.19 U2.M2 | U1.K3 v46.25,26.29 | v62.25,22.29 U3.M2
  Route3 0.127: v62.25,33.19 61.82,32.77 61.4,32.77 61.28,32.64 61.28,32.38 61.4,32.26 61.72,32.26 61.85,32.13 61.85,31.88 61.72,31.75 61.4,31.75 61.28,31.62 61.28,31.37 61.4,31.24 62.23,31.24 62.36,31.11 62.36,29.46 62.23,29.34 61.91,29.34 61.78,29.21 61.78,28.36 v62.25,27.89 61.85,27.49 61.85,24.89 61.98,24.77 62.55,24.77 62.67,24.64 62.67,24.51 62.55,24.38 61.98,24.38 61.85,24.26 61.85,24.13 61.98,24 62.55,24 62.67,23.88 62.67,23.75 62.55,23.62 61.98,23.62 61.85,23.5 61.85,22.69 v62.25,22.29
  Bottom 0.127: v46.25,26.29 46.44,26.29 46.94,26.8 48.26,26.8 48.51,27.05 48.51,27.69 48.64,27.81 49.28,27.81 49.4,27.94 49.4,28.45 49.53,28.58 49.66,28.58 49.78,28.45 49.78,27.81 49.91,27.69 50.04,27.69 50.17,27.81 50.17,28.45 50.29,28.58 58.29,28.58 59.38,27.49 61.08,27.49 61.21,27.62 61.21,27.94 61.34,28.07 61.47,28.07 61.59,27.94 61.59,27.62 61.72,27.5 62.04,27.5 62.25,27.71 v62.25,27.89
BA1  (via drill 0.25)
  Top 0.127: v63.05,37.19 U2.N8 | U1.L4 v45.45,27.09 | v63.05,26.29 U3.N8
  Route3 0.127: v63.05,37.19 62.65,36.79 62.65,28.89 v63.05,28.49 62.65,28.09 62.65,25.23 63.37,24.51 63.37,23.75 63.5,23.62 64.26,23.62 64.39,23.75 64.39,24.26 63.45,25.2 63.45,25.89 v63.05,26.29
  Bottom 0.127: v45.45,27.09 45.85,27.49 47.31,27.49 47.5,27.69 47.5,28.58 47.62,28.7 47.75,28.7 47.88,28.58 47.88,28.19 48.01,28.07 48.13,28.07 49.15,29.08 58.55,29.08 59.06,28.58 62.97,28.58 v63.05,28.49
BA2  (via drill 0.25)
  Top 0.127: v62.25,33.99 U2.M3 | U1.K4 v45.45,26.29 | v62.25,23.09 U3.M3
  Route13 0.127: v62.25,23.09 62.25,23.35 62.1,23.5 61.72,23.5 61.59,23.62 61.59,23.75 61.72,23.88 63.06,23.88 63.18,24 63.18,24.13 63.06,24.26 61.72,24.26 61.59,24.38 61.59,24.51 61.72,24.64 63.06,24.64 63.18,24.77 63.18,24.89 63.06,25.02 62.8,25.02 62.65,25.17 62.65,27.49 v63.05,27.89 62.17,28.78 62.17,30.54 62.36,30.73 62.74,30.73 62.86,30.86 62.86,30.99 62.74,31.11 61.98,31.11 61.85,31.24 61.85,31.37 61.98,31.5 63.25,31.5 63.37,31.62 63.37,31.75 63.25,31.88 62.86,31.88 62.65,32.09 62.65,33.59 v62.25,33.99
  Bottom 0.127: v45.45,26.29 45.85,26.69 46.45,26.69 46.81,27.05 47.24,27.05 48.01,27.81 48.26,27.81 49.28,28.83 58.42,28.83 58.93,28.32 62.62,28.32 v63.05,27.89
CASN  (via drill 0.25)
  Top 0.127: v59.85,33.99 U2.K3 | U1.U3 v46.25,31.89 | v59.05,23.89 U3.K3